# EAGLE design coracao_8bits (EAGLE 8.1.0)
CNAME: Chaveiro no formato de coracao de 8bits; CREVISION: 1.0; DESIGNER: Pedro Pinheiro

## Sheet 1 of 6
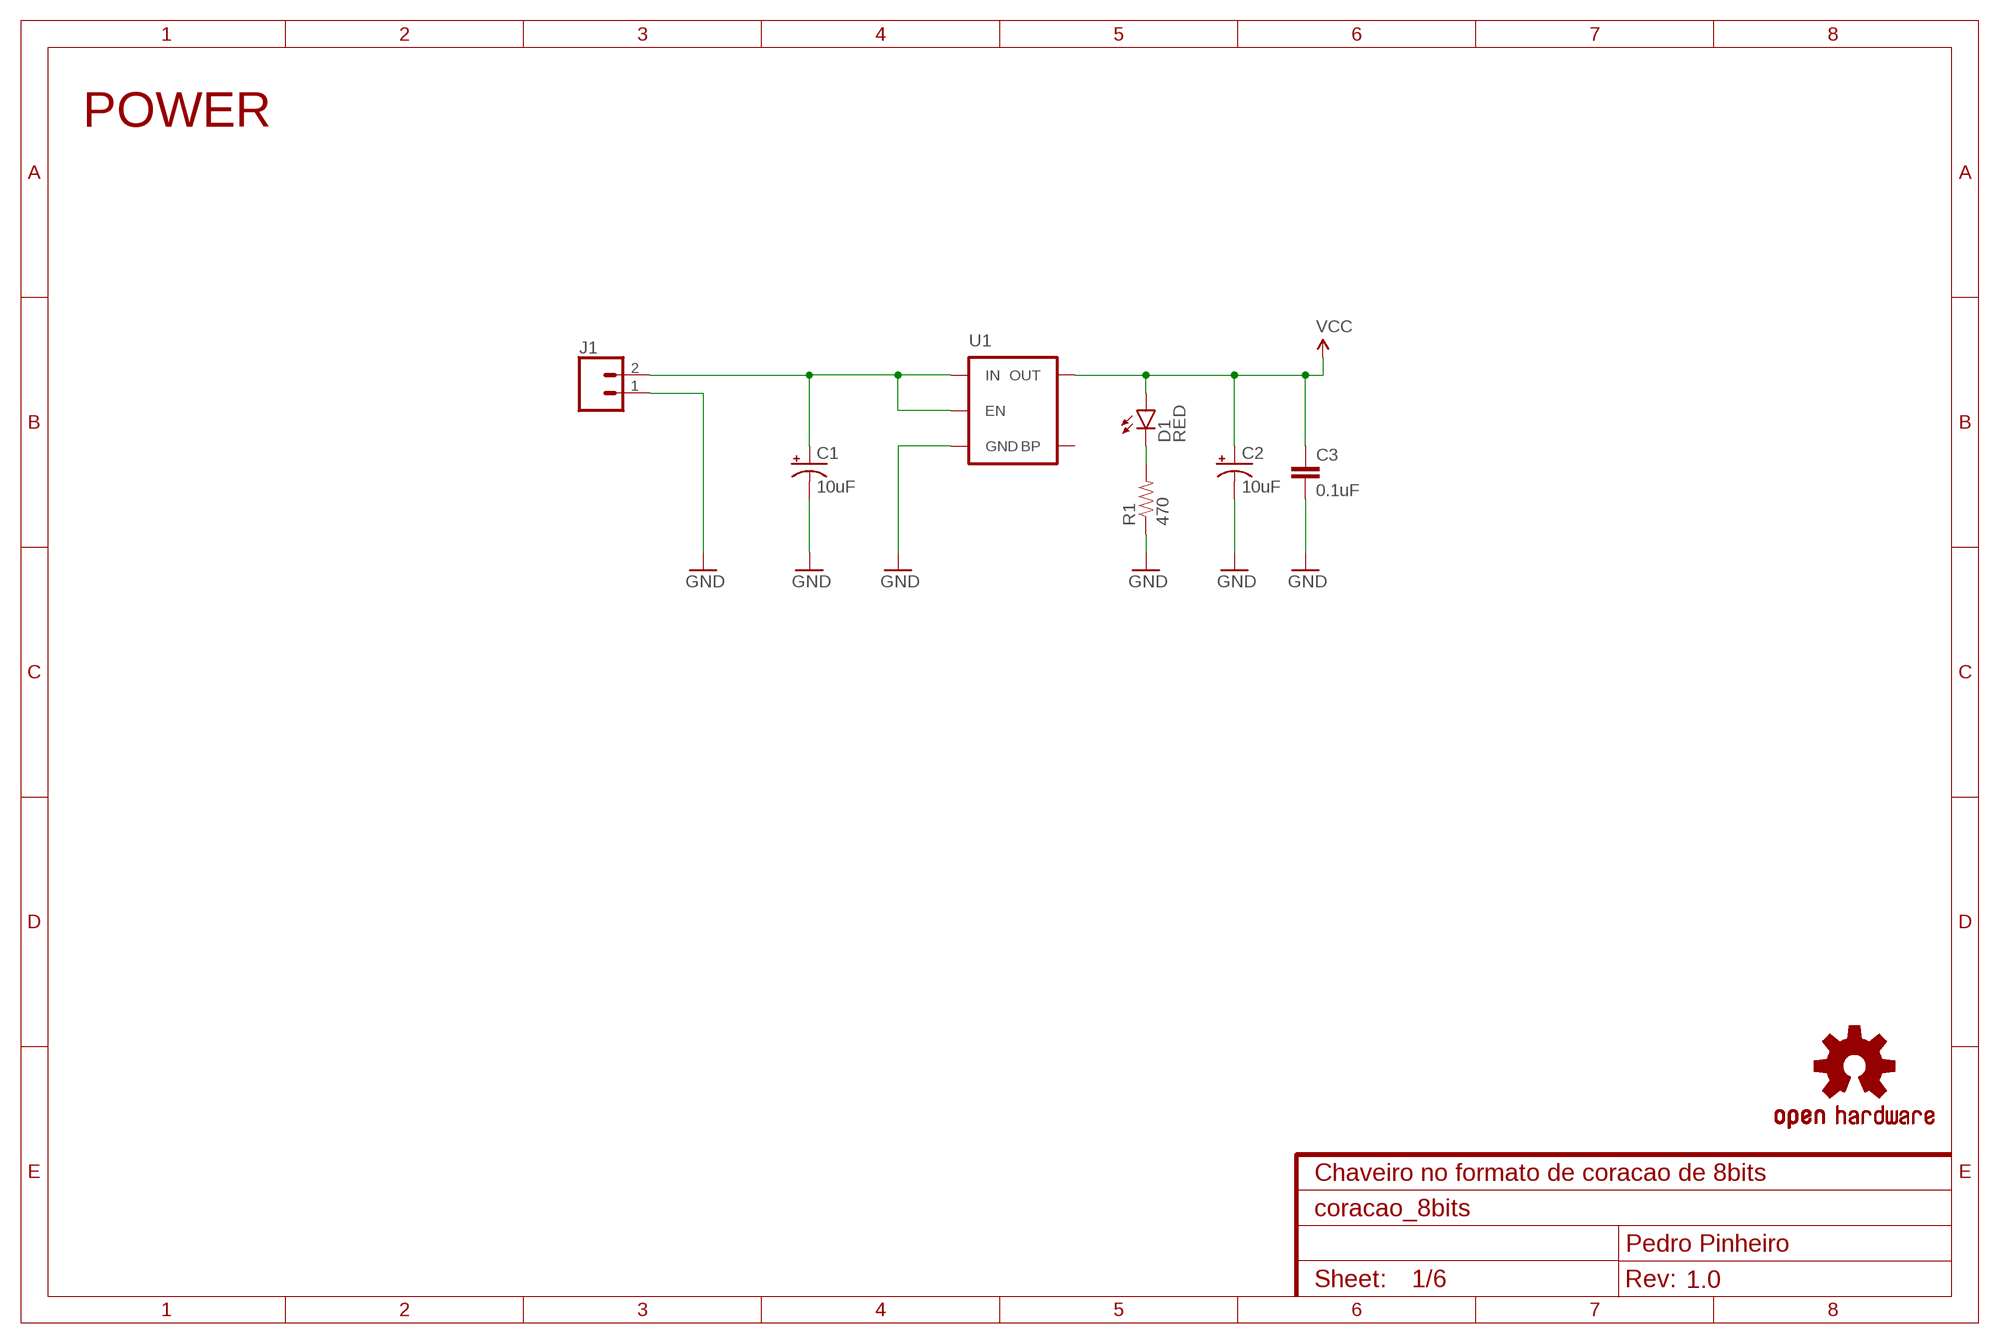
[diagram p0: schematic, sheet 1]

### Parts
C1  10uF  CAP_POL1206  [EIA3216]
C2  10uF  CAP_POL1206  [EIA3216]
C3  0.1uF  0.1UF-25V-5%(0603)  [0603-CAP]
D1  RED  LED-RED0603  [LED-0603]
J1  CONN_02  [1X02]
LOGO1  OSHW-LOGOMINI  [OSHW-LOGO-MINI]
R1  470  470OHM1/10W1%(0603)  [0603-RES]
U1  MIC52053.3V  [SOT23-5]

### Nets
DEETE: C1.A(+) J1.2 U1.1(IN) U1.3(EN)
GND: C1.C(-) C2.C(-) C3.2 J1.1 R1.1 U1.2(GND) ; also sheet 2,3,4,5,6
N$32: D1.C R1.2
VCC: C2.A(+) C3.1 D1.A U1.5(OUT) ; also sheet 2,3,4
Unconnected: U1.4(BP)

### Notes on the sheet
- POWER

## Sheet 2 of 6
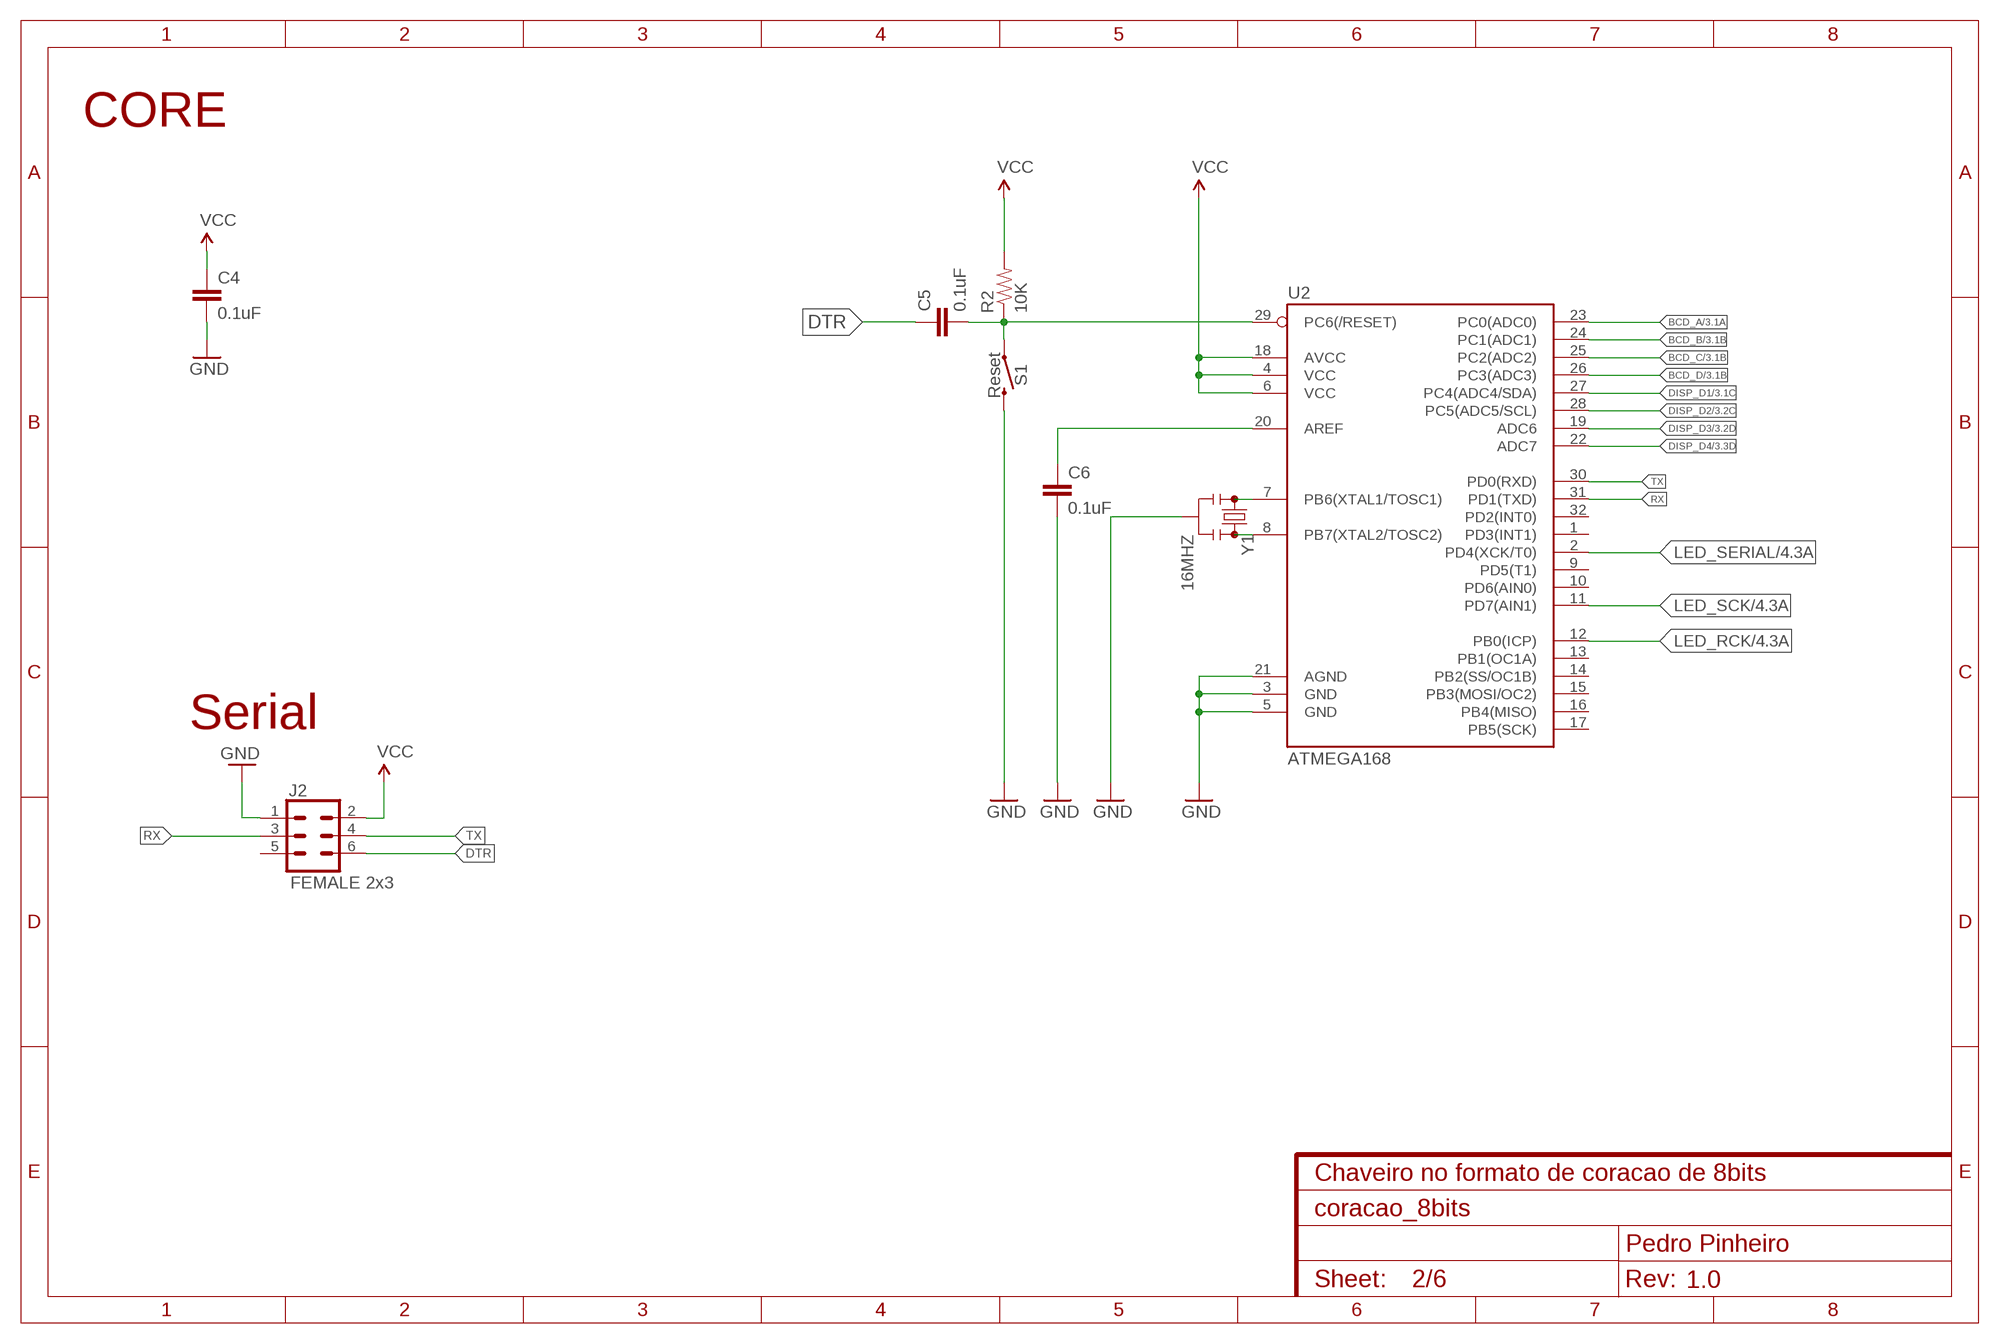
[diagram p1: schematic, sheet 2]

### Parts
C4  0.1uF  0.1UF-100V-10%(0603)  [0603-CAP]
C5  0.1uF  0.1UF-100V-10%(0603)  [0603-CAP]
C6  0.1uF  0.1UF-100V-10%(0603)  [0603-CAP]
J2  FEMALE 2x3  CONN_03X2FEMALE  [2X3]
R2  10K  10KOHM-1/10W-1%(0603)0603  [0603-RES]
S1  Reset  MOMENTARY-SWITCH-SPST-SMD-6.0X3.5MM  [TACTILE_SWITCH_SMD_6.0X3.5MM]
U2  ATMEGA168  [TQFP32-08]
Y1  16MHZ  RESONATOR16MHZ  [RESONATOR-SMD]

### Nets
BCD_A: U2.23(PC0(ADC0)) ; also sheet 3
BCD_B: U2.24(PC1(ADC1)) ; also sheet 3
BCD_C: U2.25(PC2(ADC2)) ; also sheet 3
BCD_D: U2.26(PC3(ADC3)) ; also sheet 3
DISP_D1: U2.27(PC4(ADC4/SDA)) ; also sheet 3
DISP_D2: U2.28(PC5(ADC5/SCL)) ; also sheet 3
DISP_D3: U2.19(ADC6) ; also sheet 3
DISP_D4: U2.22(ADC7) ; also sheet 3
DTR: C5.1 J2.6
GND: C4.2 C6.2 J2.1 S1.2 U2.3(GND) U2.5(GND) U2.21(AGND) Y1.2 ; also sheet 1,3,4,5,6
LED_RCK: U2.12(PB0(ICP)) ; also sheet 4
LED_SCK: U2.11(PD7(AIN1)) ; also sheet 4
LED_SERIAL: U2.2(PD4(XCK/T0)) ; also sheet 4
N$27: U2.7(PB6(XTAL1/TOSC1)) Y1.1
N$28: U2.8(PB7(XTAL2/TOSC2)) Y1.3
N$29: C6.1 U2.20(AREF)
N$30: C5.2 R2.1 S1.1 U2.29(PC6(/RESET))
RX: J2.3 U2.31(PD1(TXD))
TX: J2.4 U2.30(PD0(RXD))
VCC: C4.1 J2.2 R2.2 U2.4(VCC) U2.6(VCC) U2.18(AVCC) ; also sheet 1,3,4
Unconnected: J2.5 U2.1(PD3(INT1)) U2.9(PD5(T1)) U2.10(PD6(AIN0)) U2.13(PB1(OC1A)) U2.14(PB2(SS/OC1B)) U2.15(PB3(MOSI/OC2)) U2.16(PB4(MISO)) U2.17(PB5(SCK)) U2.32(PD2(INT0))

### Notes on the sheet
- CORE
- Serial

## Sheet 3 of 6
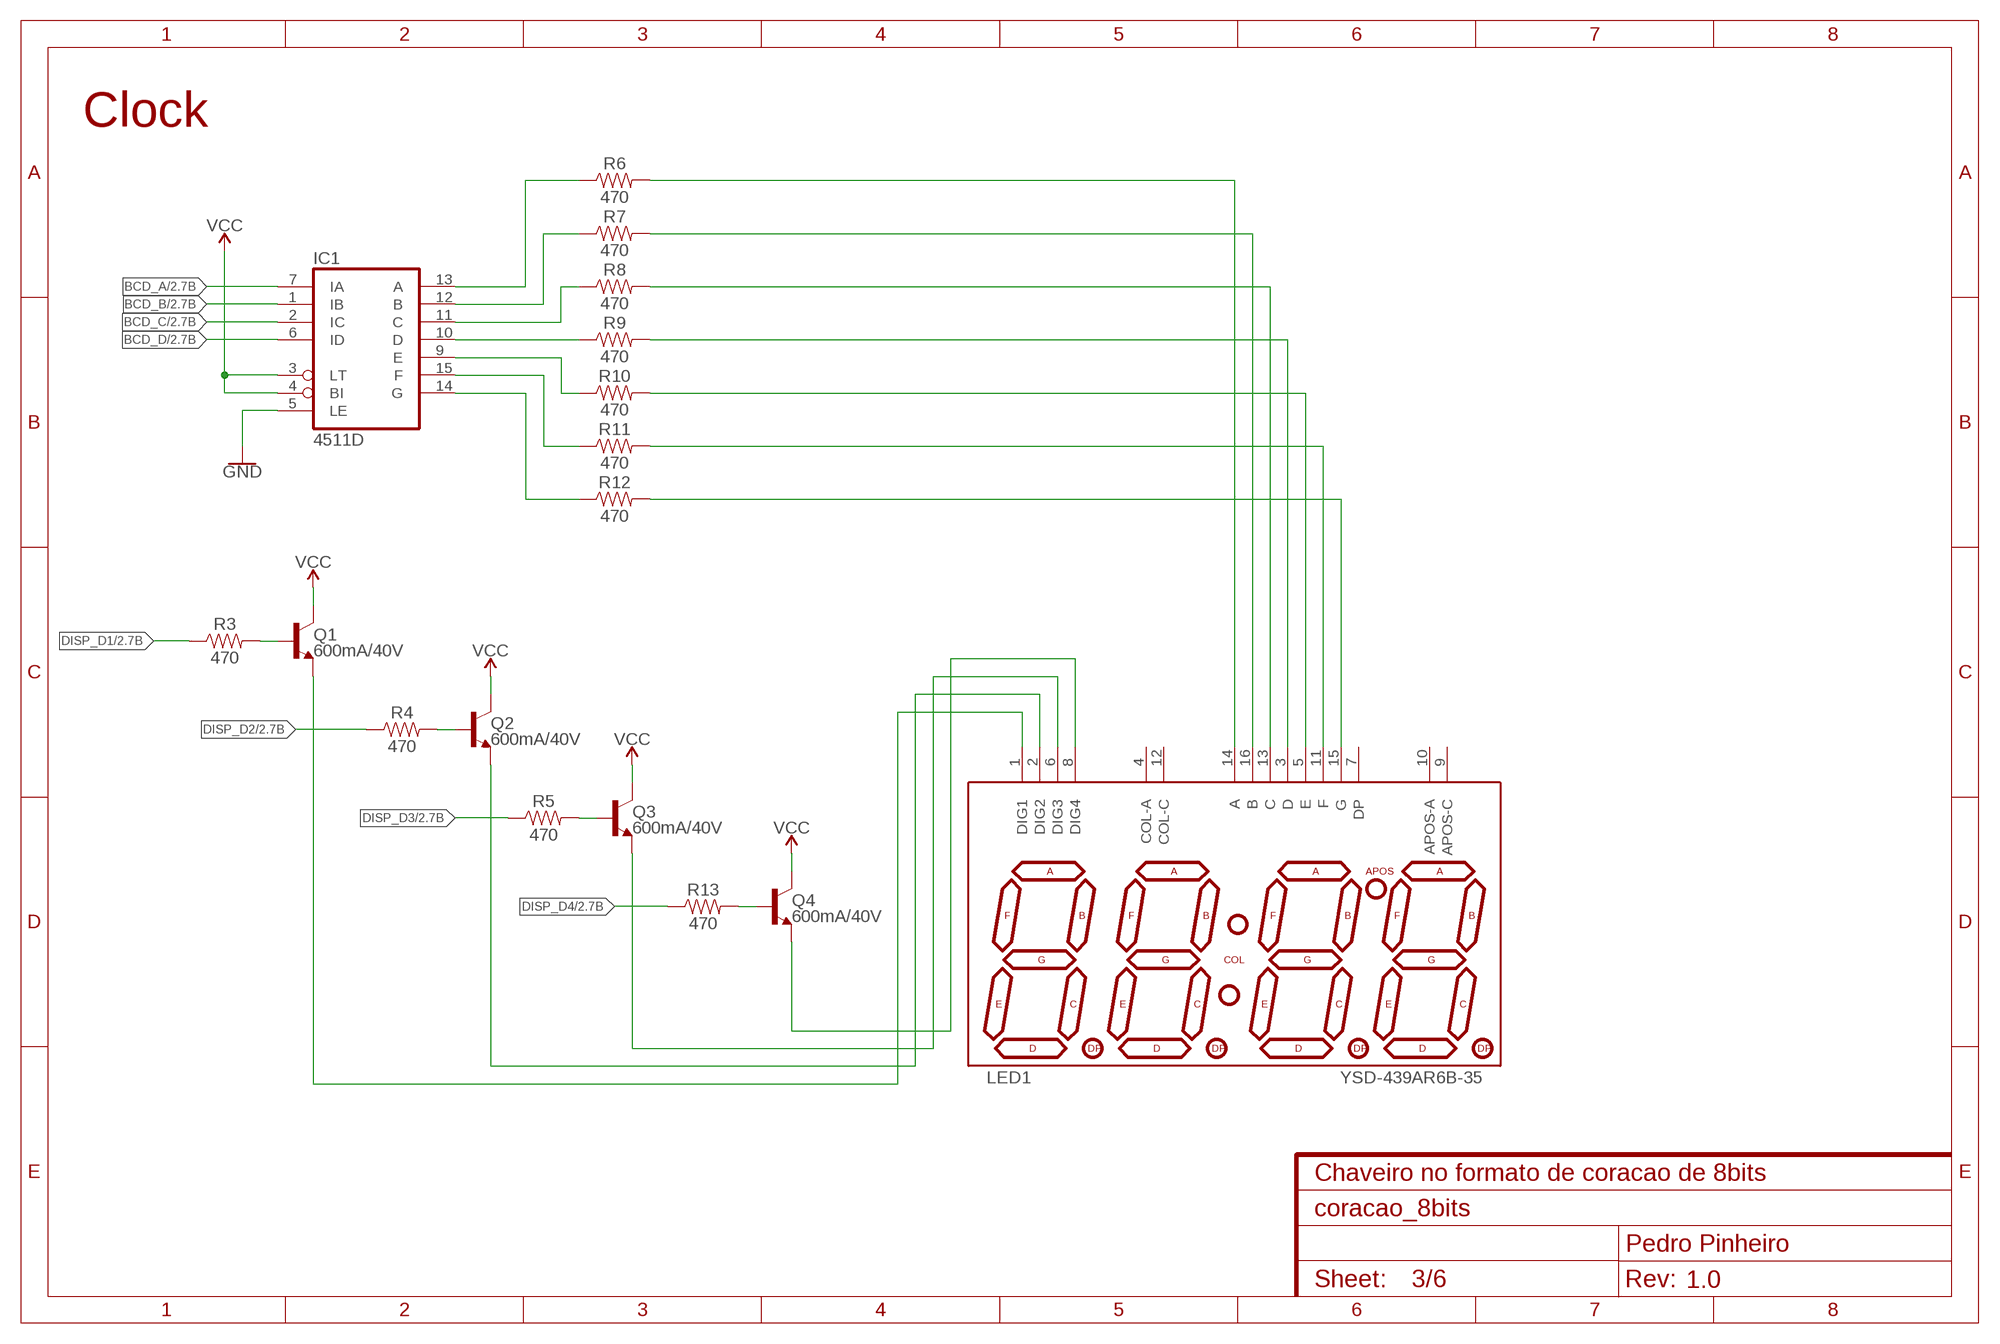
[diagram p2: schematic, sheet 3]

### Parts
IC1  4511D  [SO16]
LED1  YSD-439AR6B-35  7-SEGMENT-4DIGIT-10MM-RED  [7-SEGMENT-4DIGIT-YOUNGSUN]
Q1  600mA/40V  TRANS_NPN-MMBT2222AL  [SOT23-3]
Q2  600mA/40V  TRANS_NPN-MMBT2222AL  [SOT23-3]
Q3  600mA/40V  TRANS_NPN-MMBT2222AL  [SOT23-3]
Q4  600mA/40V  TRANS_NPN-MMBT2222AL  [SOT23-3]
R3  470  470OHM-0603-1/10W-1%  [0603]
R4  470  470OHM-0603-1/10W-1%  [0603]
R5  470  470OHM-0603-1/10W-1%  [0603]
R6  470  470OHM-0603-1/10W-1%  [0603]
R7  470  470OHM-0603-1/10W-1%  [0603]
R8  470  470OHM-0603-1/10W-1%  [0603]
R9  470  470OHM-0603-1/10W-1%  [0603]
R10  470  470OHM-0603-1/10W-1%  [0603]
R11  470  470OHM-0603-1/10W-1%  [0603]
R12  470  470OHM-0603-1/10W-1%  [0603]
R13  470  470OHM-0603-1/10W-1%  [0603]

### Nets
BCD_A: IC1.7(IA) ; also sheet 2
BCD_B: IC1.1(IB) ; also sheet 2
BCD_C: IC1.2(IC) ; also sheet 2
BCD_D: IC1.6(ID) ; also sheet 2
DISP_D1: R3.1 ; also sheet 2
DISP_D2: R4.1 ; also sheet 2
DISP_D3: R5.1 ; also sheet 2
DISP_D4: R13.1 ; also sheet 2
GND: IC1.5(LE) ; also sheet 1,2,4,5,6
N$31: IC1.10(D) R9.1
N$33: IC1.11(C) R8.1
N$34: IC1.12(B) R7.1
N$35: IC1.13(A) R6.1
N$36: IC1.9(E) R10.1
N$37: IC1.15(F) R11.1
N$38: IC1.14(G) R12.1
N$39: LED1.14(A) R6.2
N$42: LED1.16(B) R7.2
N$43: LED1.13(C) R8.2
N$44: LED1.3(D) R9.2
N$45: LED1.5(E) R10.2
N$46: LED1.11(F) R11.2
N$47: LED1.15(G) R12.2
N$48: LED1.8(DIG4) Q4.2(E)
N$49: LED1.6(DIG3) Q3.2(E)
N$50: LED1.2(DIG2) Q2.2(E)
N$51: LED1.1(DIG1) Q1.2(E)
N$52: Q2.1(B) R4.2
N$53: Q4.1(B) R13.2
N$54: Q3.1(B) R5.2
N$55: Q1.1(B) R3.2
VCC: IC1.3(LT) IC1.4(BI) Q1.3(C) Q2.3(C) Q3.3(C) Q4.3(C) ; also sheet 1,2,4
Unconnected: LED1.4(COL-A) LED1.7(DP) LED1.9(APOS-C) LED1.10(APOS-A) LED1.12(COL-C)

### Notes on the sheet
- Clock

## Sheet 4 of 6
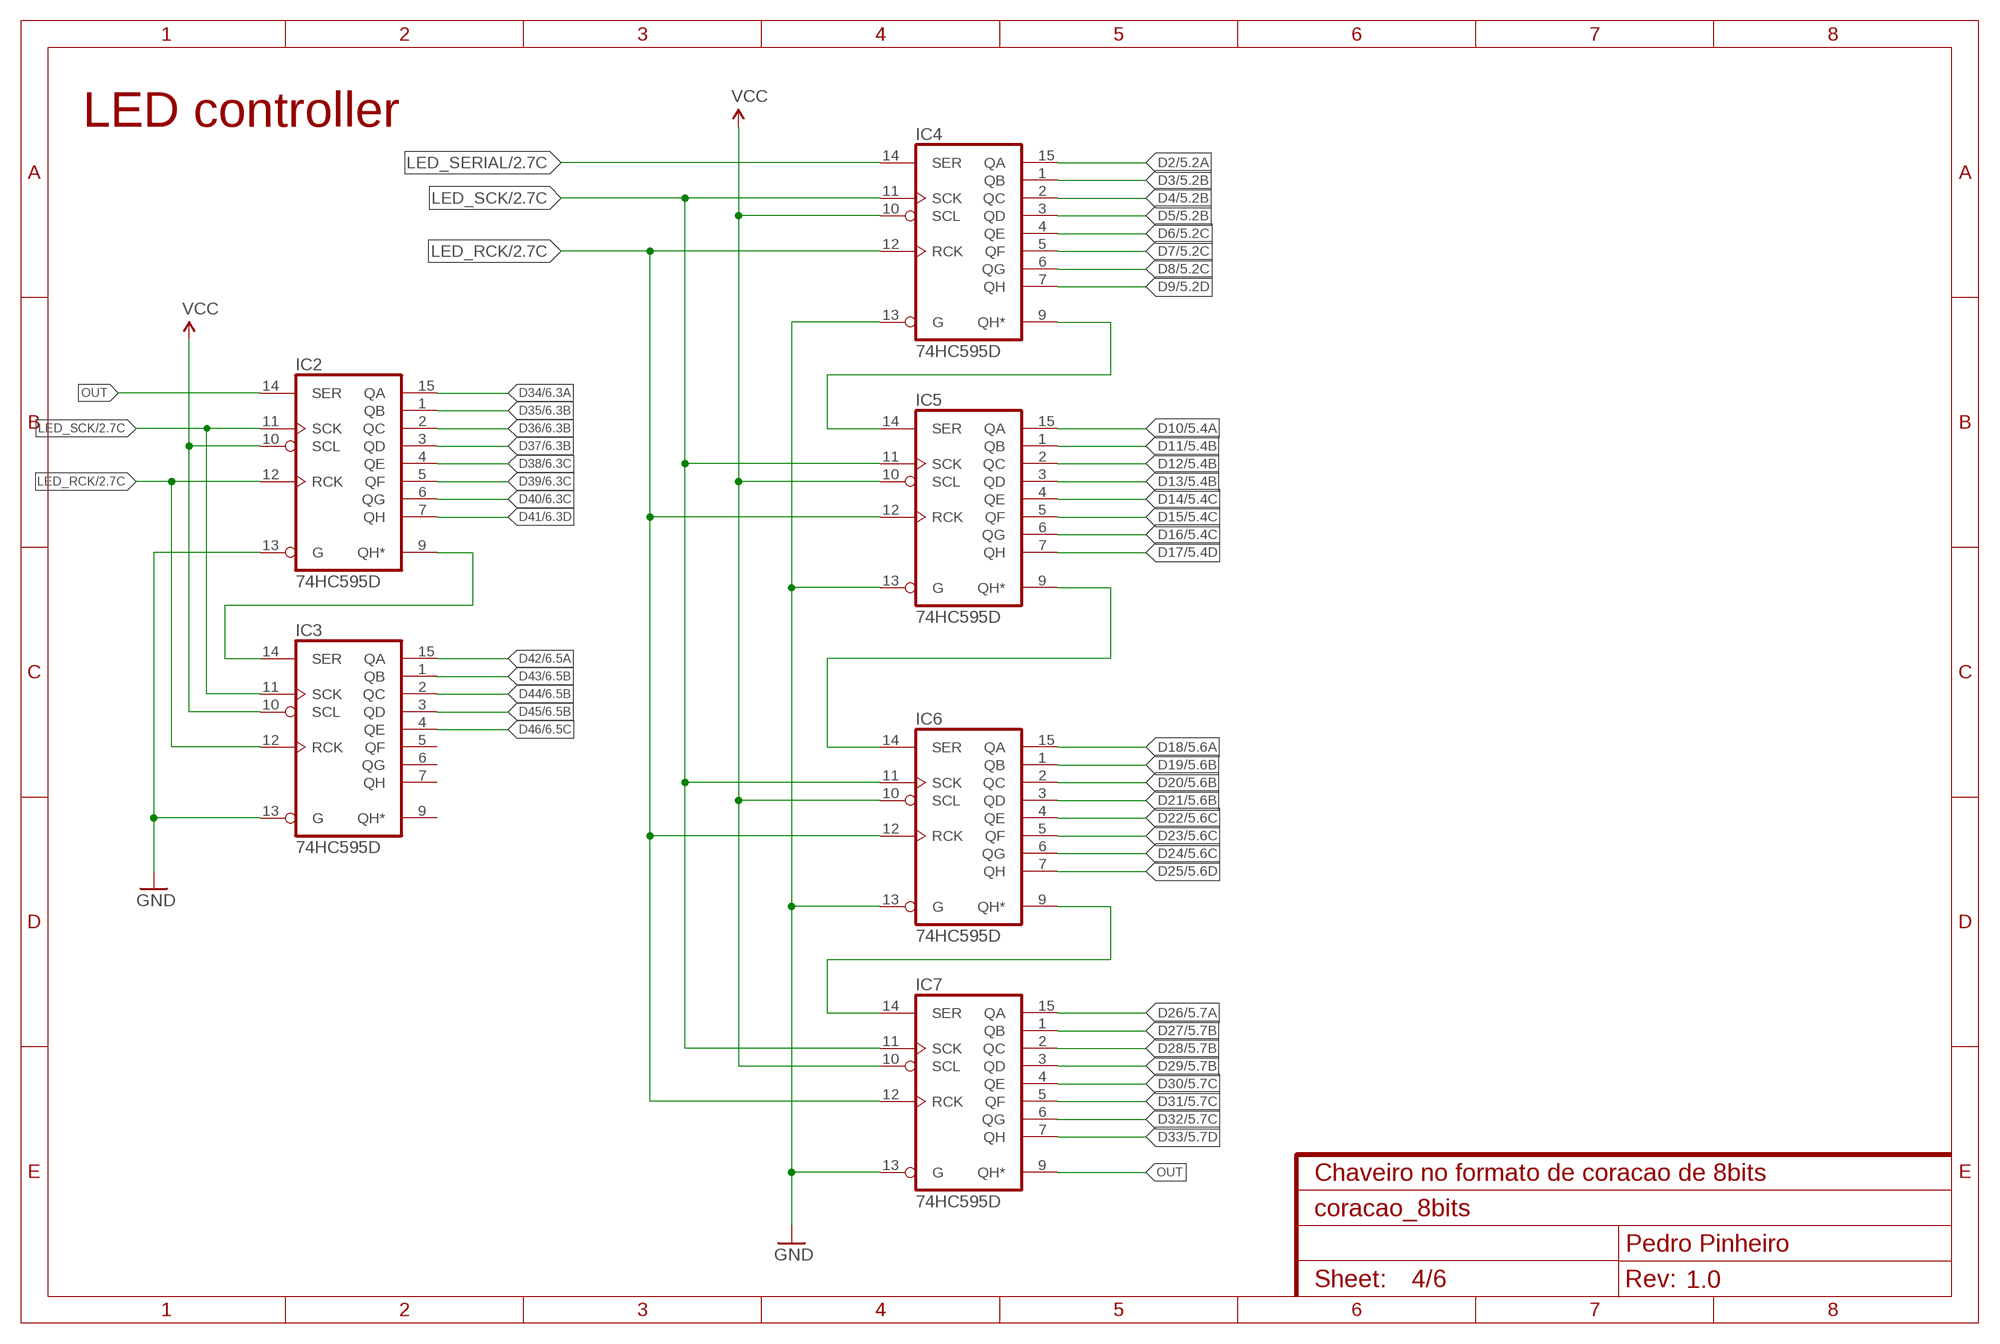
[diagram p3: schematic, sheet 4]

### Parts
IC2  74HC595D  [SO16]
IC3  74HC595D  [SO16]
IC4  74HC595D  [SO16]
IC5  74HC595D  [SO16]
IC6  74HC595D  [SO16]
IC7  74HC595D  [SO16]

### Nets
D2: IC4.15(QA) ; also sheet 5
D3: IC4.1(QB) ; also sheet 5
D4: IC4.2(QC) ; also sheet 5
D5: IC4.3(QD) ; also sheet 5
D6: IC4.4(QE) ; also sheet 5
D7: IC4.5(QF) ; also sheet 5
D8: IC4.6(QG) ; also sheet 5
D9: IC4.7(QH) ; also sheet 5
D10: IC5.15(QA) ; also sheet 5
D11: IC5.1(QB) ; also sheet 5
D12: IC5.2(QC) ; also sheet 5
D13: IC5.3(QD) ; also sheet 5
D14: IC5.4(QE) ; also sheet 5
D15: IC5.5(QF) ; also sheet 5
D16: IC5.6(QG) ; also sheet 5
D17: IC5.7(QH) ; also sheet 5
D18: IC6.15(QA) ; also sheet 5
D19: IC6.1(QB) ; also sheet 5
D20: IC6.2(QC) ; also sheet 5
D21: IC6.3(QD) ; also sheet 5
D22: IC6.4(QE) ; also sheet 5
D23: IC6.5(QF) ; also sheet 5
D24: IC6.6(QG) ; also sheet 5
D25: IC6.7(QH) ; also sheet 5
D26: IC7.15(QA) ; also sheet 5
D27: IC7.1(QB) ; also sheet 5
D28: IC7.2(QC) ; also sheet 5
D29: IC7.3(QD) ; also sheet 5
D30: IC7.4(QE) ; also sheet 5
D31: IC7.5(QF) ; also sheet 5
D32: IC7.6(QG) ; also sheet 5
D33: IC7.7(QH) ; also sheet 5
D34: IC2.15(QA) ; also sheet 6
D35: IC2.1(QB) ; also sheet 6
D36: IC2.2(QC) ; also sheet 6
D37: IC2.3(QD) ; also sheet 6
D38: IC2.4(QE) ; also sheet 6
D39: IC2.5(QF) ; also sheet 6
D40: IC2.6(QG) ; also sheet 6
D41: IC2.7(QH) ; also sheet 6
D42: IC3.15(QA) ; also sheet 6
D43: IC3.1(QB) ; also sheet 6
D44: IC3.2(QC) ; also sheet 6
D45: IC3.3(QD) ; also sheet 6
D46: IC3.4(QE) ; also sheet 6
GND: IC2.13(G) IC3.13(G) IC4.13(G) IC5.13(G) IC6.13(G) IC7.13(G) ; also sheet 1,2,3,5,6
LED_RCK: IC2.12(RCK) IC3.12(RCK) IC4.12(RCK) IC5.12(RCK) IC6.12(RCK) IC7.12(RCK) ; also sheet 2
LED_SCK: IC2.11(SCK) IC3.11(SCK) IC4.11(SCK) IC5.11(SCK) IC6.11(SCK) IC7.11(SCK) ; also sheet 2
LED_SERIAL: IC4.14(SER) ; also sheet 2
N$40: IC4.9(QH*) IC5.14(SER)
N$41: IC6.9(QH*) IC7.14(SER)
N$63: IC2.9(QH*) IC3.14(SER)
N$104: IC5.9(QH*) IC6.14(SER)
OUT: IC2.14(SER) IC7.9(QH*)
VCC: IC2.10(SCL) IC3.10(SCL) IC4.10(SCL) IC5.10(SCL) IC6.10(SCL) IC7.10(SCL) ; also sheet 1,2,3
Unconnected: IC3.5(QF) IC3.6(QG) IC3.7(QH) IC3.9(QH*)

### Notes on the sheet
- LED controller

## Sheet 5 of 6
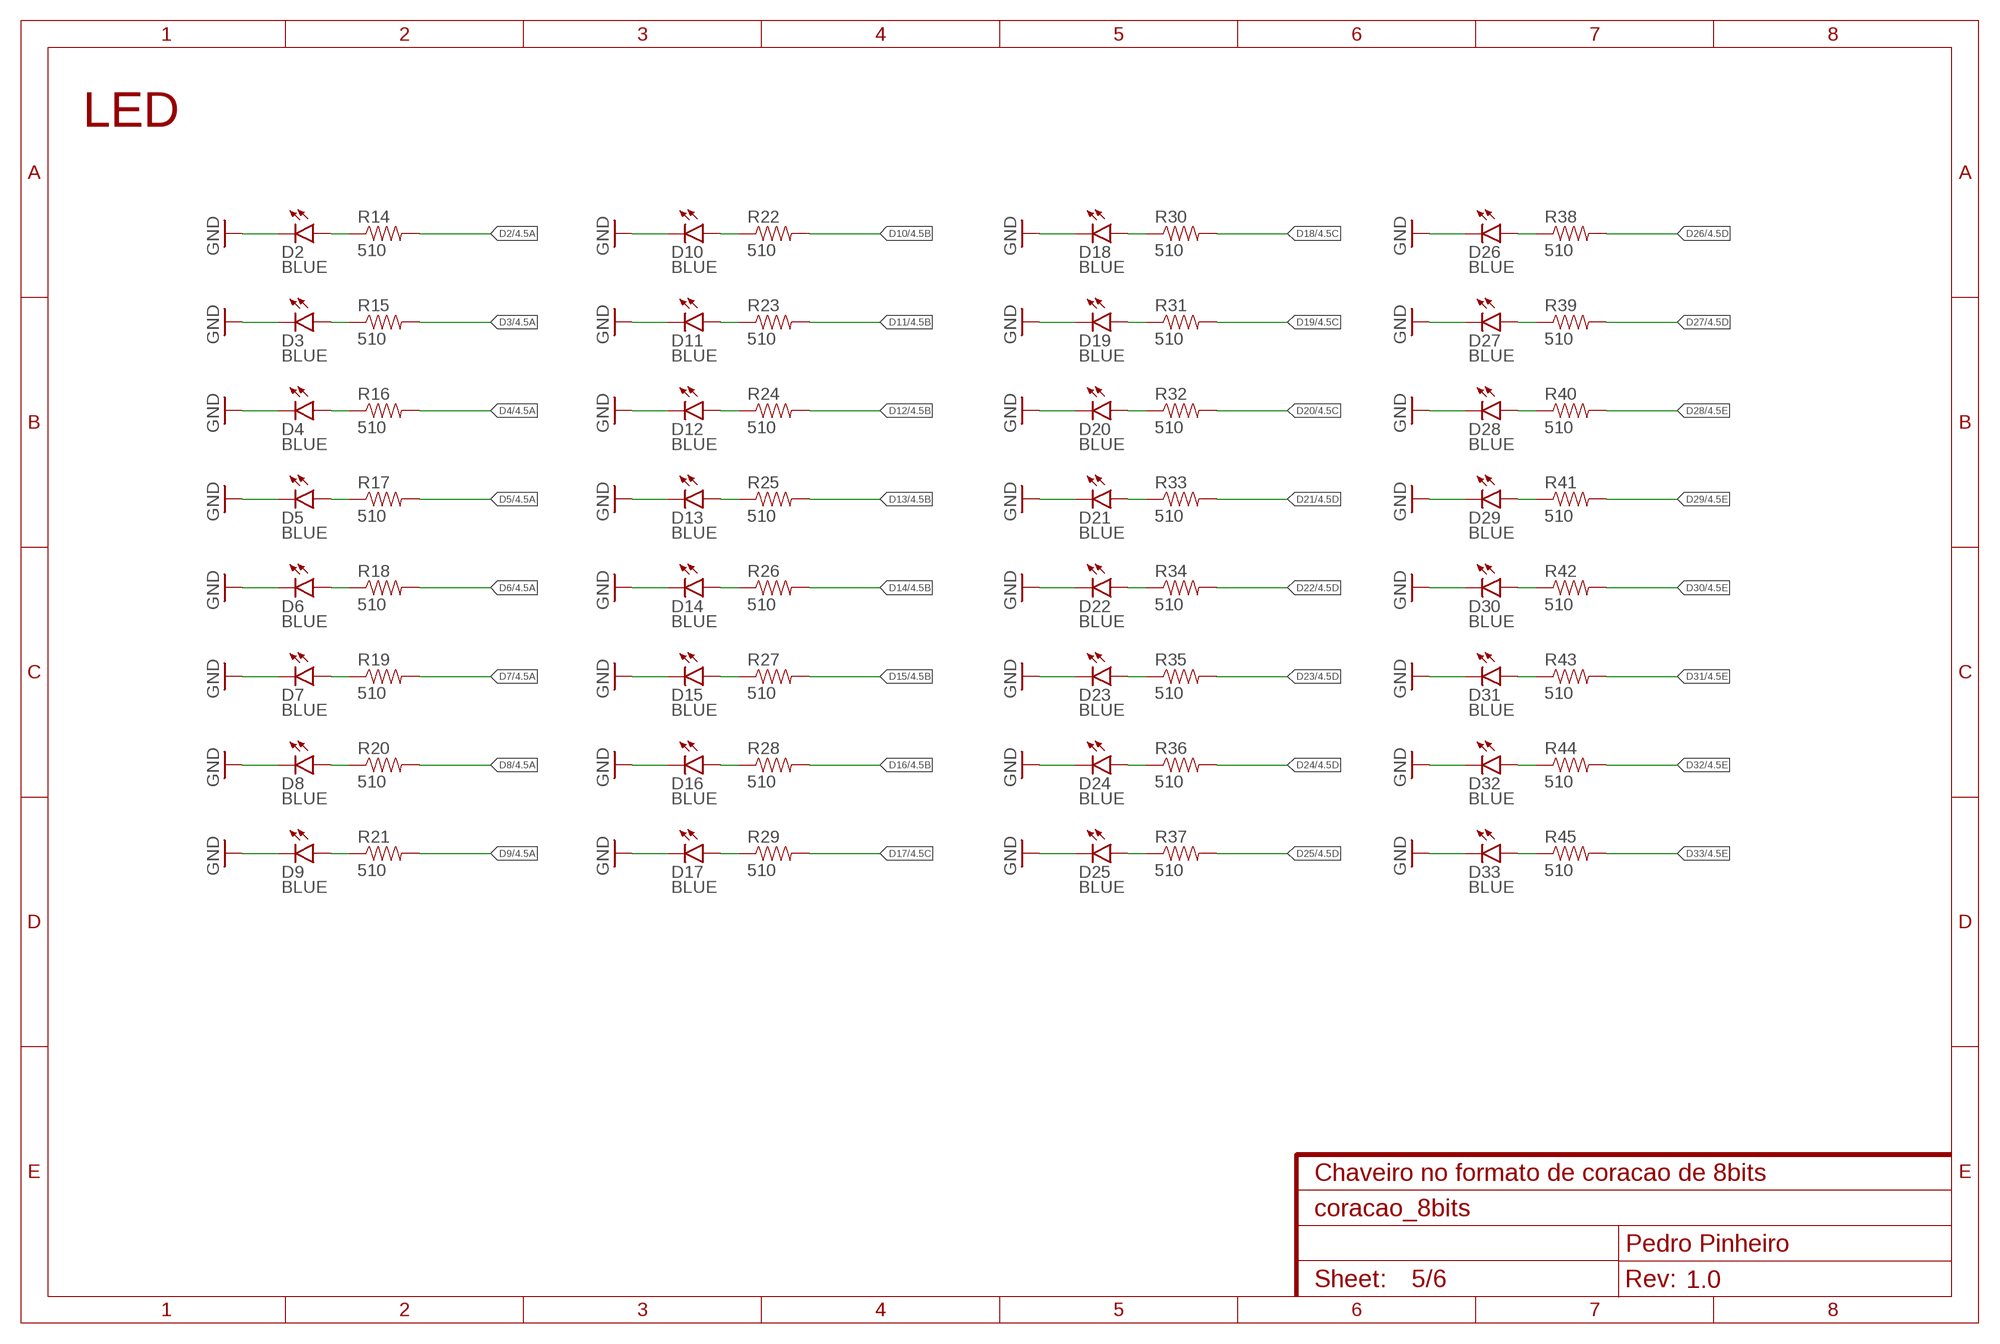
[diagram p4: schematic, sheet 5]

### Parts
D2  BLUE  LED-BLUE0603  [LED-0603]
D3  BLUE  LED-BLUE0603  [LED-0603]
D4  BLUE  LED-BLUE0603  [LED-0603]
D5  BLUE  LED-BLUE0603  [LED-0603]
D6  BLUE  LED-BLUE0603  [LED-0603]
D7  BLUE  LED-BLUE0603  [LED-0603]
D8  BLUE  LED-BLUE0603  [LED-0603]
D9  BLUE  LED-BLUE0603  [LED-0603]
D10  BLUE  LED-BLUE0603  [LED-0603]
D11  BLUE  LED-BLUE0603  [LED-0603]
D12  BLUE  LED-BLUE0603  [LED-0603]
D13  BLUE  LED-BLUE0603  [LED-0603]
D14  BLUE  LED-BLUE0603  [LED-0603]
D15  BLUE  LED-BLUE0603  [LED-0603]
D16  BLUE  LED-BLUE0603  [LED-0603]
D17  BLUE  LED-BLUE0603  [LED-0603]
D18  BLUE  LED-BLUE0603  [LED-0603]
D19  BLUE  LED-BLUE0603  [LED-0603]
D20  BLUE  LED-BLUE0603  [LED-0603]
D21  BLUE  LED-BLUE0603  [LED-0603]
D22  BLUE  LED-BLUE0603  [LED-0603]
D23  BLUE  LED-BLUE0603  [LED-0603]
D24  BLUE  LED-BLUE0603  [LED-0603]
D25  BLUE  LED-BLUE0603  [LED-0603]
D26  BLUE  LED-BLUE0603  [LED-0603]
D27  BLUE  LED-BLUE0603  [LED-0603]
D28  BLUE  LED-BLUE0603  [LED-0603]
D29  BLUE  LED-BLUE0603  [LED-0603]
D30  BLUE  LED-BLUE0603  [LED-0603]
D31  BLUE  LED-BLUE0603  [LED-0603]
D32  BLUE  LED-BLUE0603  [LED-0603]
D33  BLUE  LED-BLUE0603  [LED-0603]
R14  510  470OHM1/10W1%(0603)  [0603-RES]
R15  510  470OHM1/10W1%(0603)  [0603-RES]
R16  510  470OHM1/10W1%(0603)  [0603-RES]
R17  510  470OHM1/10W1%(0603)  [0603-RES]
R18  510  470OHM1/10W1%(0603)  [0603-RES]
R19  510  470OHM1/10W1%(0603)  [0603-RES]
R20  510  470OHM1/10W1%(0603)  [0603-RES]
R21  510  470OHM1/10W1%(0603)  [0603-RES]
R22  510  470OHM1/10W1%(0603)  [0603-RES]
R23  510  470OHM1/10W1%(0603)  [0603-RES]
R24  510  470OHM1/10W1%(0603)  [0603-RES]
R25  510  470OHM1/10W1%(0603)  [0603-RES]
R26  510  470OHM1/10W1%(0603)  [0603-RES]
R27  510  470OHM1/10W1%(0603)  [0603-RES]
R28  510  470OHM1/10W1%(0603)  [0603-RES]
R29  510  470OHM1/10W1%(0603)  [0603-RES]
R30  510  470OHM1/10W1%(0603)  [0603-RES]
R31  510  470OHM1/10W1%(0603)  [0603-RES]
R32  510  470OHM1/10W1%(0603)  [0603-RES]
R33  510  470OHM1/10W1%(0603)  [0603-RES]
R34  510  470OHM1/10W1%(0603)  [0603-RES]
R35  510  470OHM1/10W1%(0603)  [0603-RES]
R36  510  470OHM1/10W1%(0603)  [0603-RES]
R37  510  470OHM1/10W1%(0603)  [0603-RES]
R38  510  470OHM1/10W1%(0603)  [0603-RES]
R39  510  470OHM1/10W1%(0603)  [0603-RES]
R40  510  470OHM1/10W1%(0603)  [0603-RES]
R41  510  470OHM1/10W1%(0603)  [0603-RES]
R42  510  470OHM1/10W1%(0603)  [0603-RES]
R43  510  470OHM1/10W1%(0603)  [0603-RES]
R44  510  470OHM1/10W1%(0603)  [0603-RES]
R45  510  470OHM1/10W1%(0603)  [0603-RES]

### Nets
D2: R14.2 ; also sheet 4
D3: R15.2 ; also sheet 4
D4: R16.2 ; also sheet 4
D5: R17.2 ; also sheet 4
D6: R18.2 ; also sheet 4
D7: R19.2 ; also sheet 4
D8: R20.2 ; also sheet 4
D9: R21.2 ; also sheet 4
D10: R22.2 ; also sheet 4
D11: R23.2 ; also sheet 4
D12: R24.2 ; also sheet 4
D13: R25.2 ; also sheet 4
D14: R26.2 ; also sheet 4
D15: R27.2 ; also sheet 4
D16: R28.2 ; also sheet 4
D17: R29.2 ; also sheet 4
D18: R30.2 ; also sheet 4
D19: R31.2 ; also sheet 4
D20: R32.2 ; also sheet 4
D21: R33.2 ; also sheet 4
D22: R34.2 ; also sheet 4
D23: R35.2 ; also sheet 4
D24: R36.2 ; also sheet 4
D25: R37.2 ; also sheet 4
D26: R38.2 ; also sheet 4
D27: R39.2 ; also sheet 4
D28: R40.2 ; also sheet 4
D29: R41.2 ; also sheet 4
D30: R42.2 ; also sheet 4
D31: R43.2 ; also sheet 4
D32: R44.2 ; also sheet 4
D33: R45.2 ; also sheet 4
GND: D2.C D3.C D4.C D5.C D6.C D7.C D8.C D9.C D10.C D11.C D12.C D13.C D14.C D15.C D16.C D17.C D18.C D19.C D20.C D21.C D22.C D23.C D24.C D25.C D26.C D27.C D28.C D29.C D30.C D31.C D32.C D33.C ; also sheet 1,2,3,4,6
N$1: D2.A R14.1
N$2: D3.A R15.1
N$3: D4.A R16.1
N$4: D5.A R17.1
N$5: D6.A R18.1
N$6: D7.A R19.1
N$7: D8.A R20.1
N$8: D9.A R21.1
N$9: D10.A R22.1
N$10: D11.A R23.1
N$11: D12.A R24.1
N$12: D13.A R25.1
N$13: D14.A R26.1
N$14: D15.A R27.1
N$15: D16.A R28.1
N$16: D17.A R29.1
N$17: D18.A R30.1
N$18: D19.A R31.1
N$19: D20.A R32.1
N$20: D21.A R33.1
N$21: D22.A R34.1
N$22: D23.A R35.1
N$23: D24.A R36.1
N$24: D25.A R37.1
N$25: D26.A R38.1
N$26: D27.A R39.1
N$56: D28.A R40.1
N$57: D29.A R41.1
N$58: D30.A R42.1
N$59: D31.A R43.1
N$60: D32.A R44.1
N$61: D33.A R45.1

### Notes on the sheet
- LED

## Sheet 6 of 6
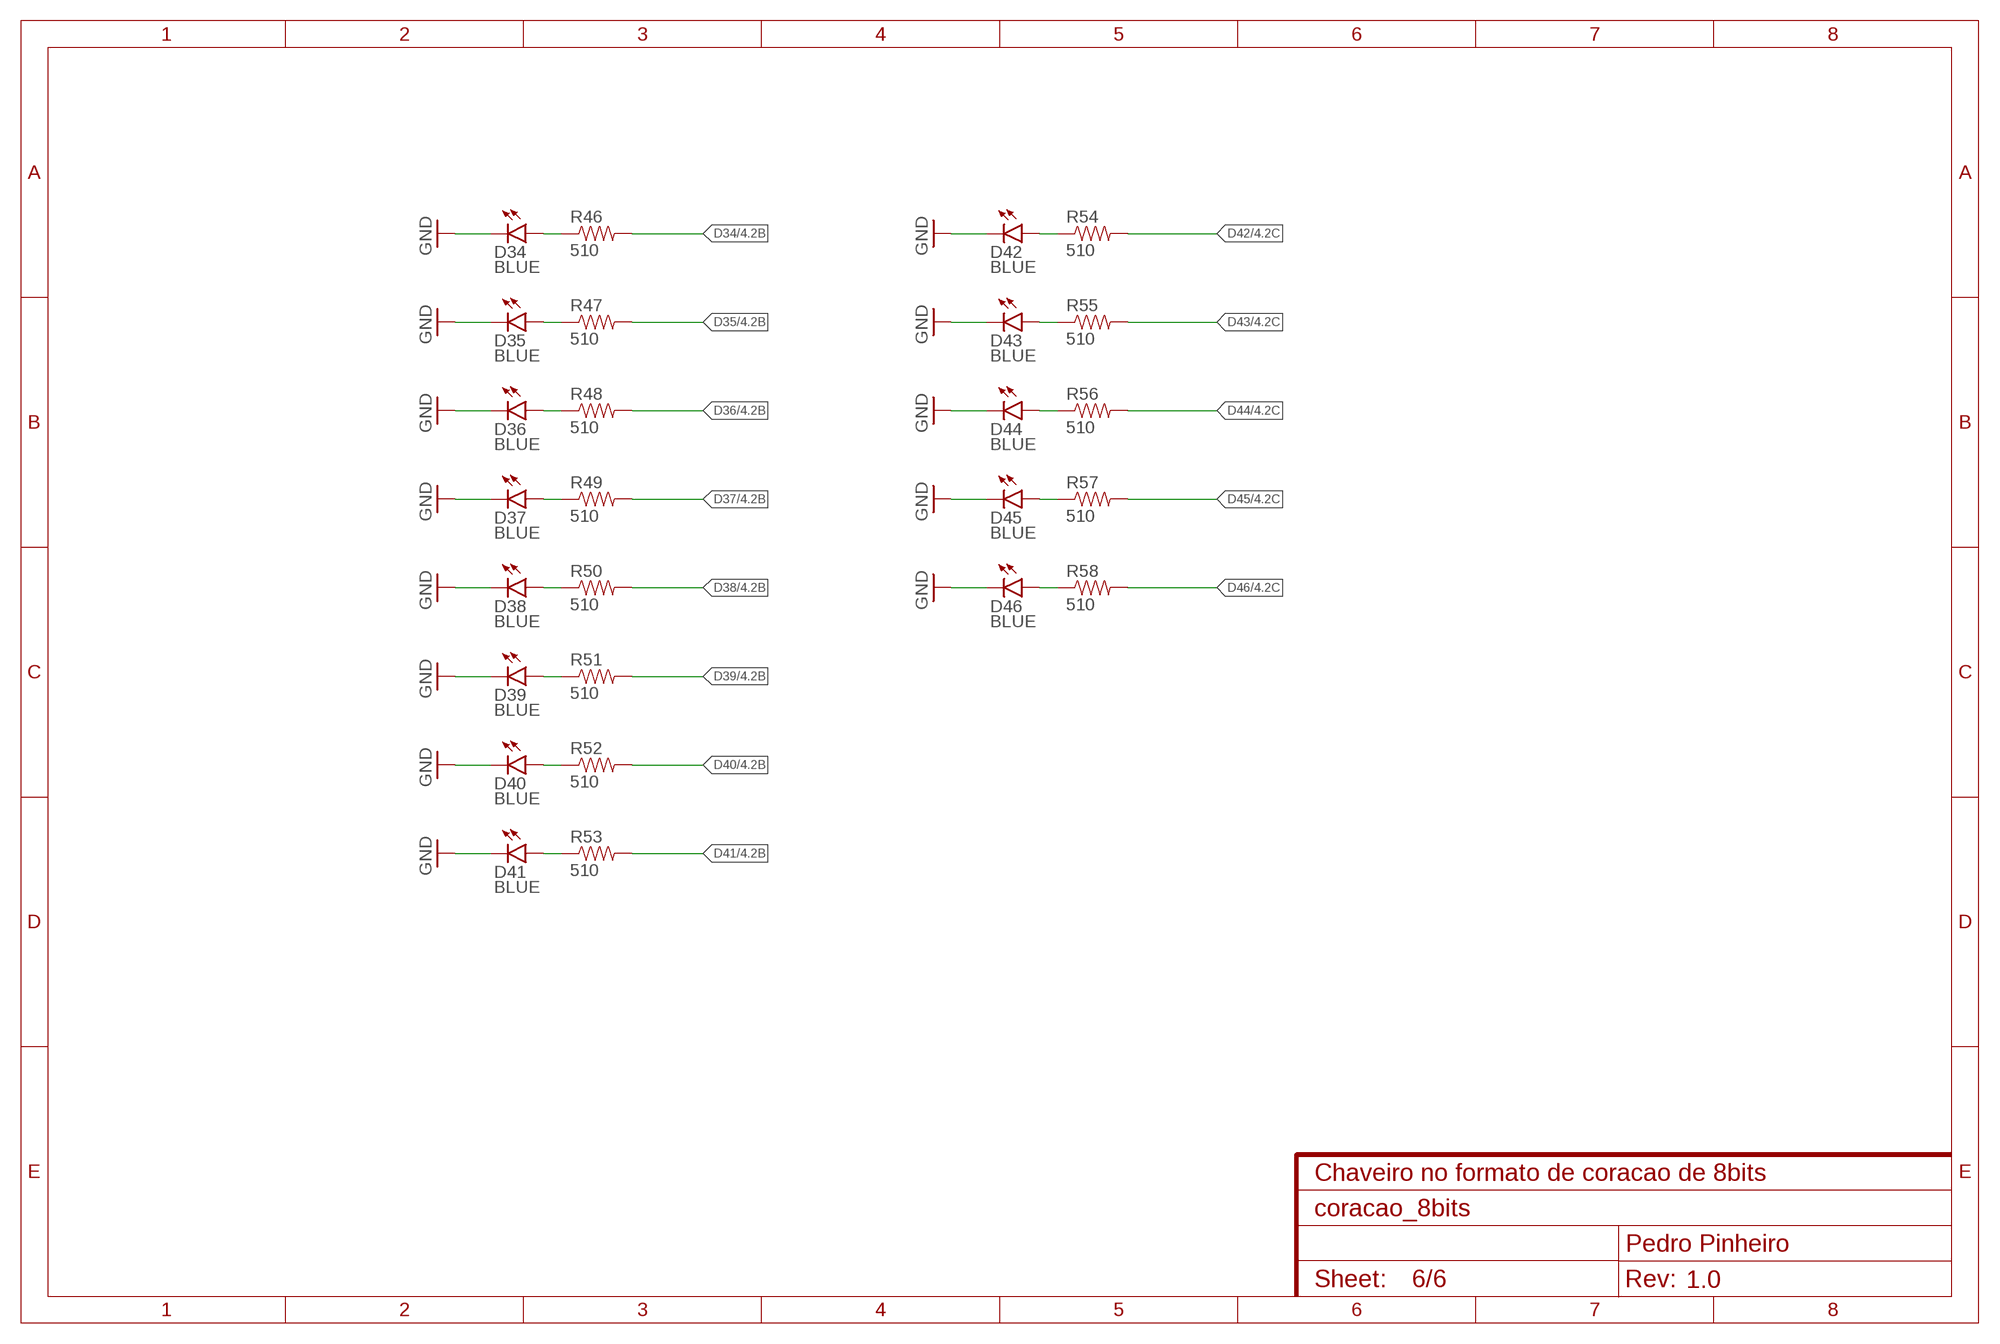
[diagram p5: schematic, sheet 6]

### Parts
D34  BLUE  LED-BLUE0603  [LED-0603]
D35  BLUE  LED-BLUE0603  [LED-0603]
D36  BLUE  LED-BLUE0603  [LED-0603]
D37  BLUE  LED-BLUE0603  [LED-0603]
D38  BLUE  LED-BLUE0603  [LED-0603]
D39  BLUE  LED-BLUE0603  [LED-0603]
D40  BLUE  LED-BLUE0603  [LED-0603]
D41  BLUE  LED-BLUE0603  [LED-0603]
D42  BLUE  LED-BLUE0603  [LED-0603]
D43  BLUE  LED-BLUE0603  [LED-0603]
D44  BLUE  LED-BLUE0603  [LED-0603]
D45  BLUE  LED-BLUE0603  [LED-0603]
D46  BLUE  LED-BLUE0603  [LED-0603]
R46  510  470OHM1/10W1%(0603)  [0603-RES]
R47  510  470OHM1/10W1%(0603)  [0603-RES]
R48  510  470OHM1/10W1%(0603)  [0603-RES]
R49  510  470OHM1/10W1%(0603)  [0603-RES]
R50  510  470OHM1/10W1%(0603)  [0603-RES]
R51  510  470OHM1/10W1%(0603)  [0603-RES]
R52  510  470OHM1/10W1%(0603)  [0603-RES]
R53  510  470OHM1/10W1%(0603)  [0603-RES]
R54  510  470OHM1/10W1%(0603)  [0603-RES]
R55  510  470OHM1/10W1%(0603)  [0603-RES]
R56  510  470OHM1/10W1%(0603)  [0603-RES]
R57  510  470OHM1/10W1%(0603)  [0603-RES]
R58  510  470OHM1/10W1%(0603)  [0603-RES]

### Nets
D34: R46.2 ; also sheet 4
D35: R47.2 ; also sheet 4
D36: R48.2 ; also sheet 4
D37: R49.2 ; also sheet 4
D38: R50.2 ; also sheet 4
D39: R51.2 ; also sheet 4
D40: R52.2 ; also sheet 4
D41: R53.2 ; also sheet 4
D42: R54.2 ; also sheet 4
D43: R55.2 ; also sheet 4
D44: R56.2 ; also sheet 4
D45: R57.2 ; also sheet 4
D46: R58.2 ; also sheet 4
GND: D34.C D35.C D36.C D37.C D38.C D39.C D40.C D41.C D42.C D43.C D44.C D45.C D46.C ; also sheet 1,2,3,4,5
N$62: D34.A R46.1
N$64: D35.A R47.1
N$65: D36.A R48.1
N$66: D37.A R49.1
N$67: D38.A R50.1
N$68: D39.A R51.1
N$69: D40.A R52.1
N$70: D41.A R53.1
N$71: D42.A R54.1
N$72: D43.A R55.1
N$73: D44.A R56.1
N$74: D45.A R57.1
N$75: D46.A R58.1

## Power pins joined to a net without a drawn wire
GND: IC2.8(GND) IC3.8(GND) IC4.8(GND) IC5.8(GND) IC6.8(GND) IC7.8(GND)
VCC: IC2.16(VCC) IC3.16(VCC) IC4.16(VCC) IC5.16(VCC) IC6.16(VCC) IC7.16(VCC)
VDD: IC1.16(VDD)
VSS: IC1.8(VSS)

## Library data of the parts
C1 C2 = SparkFun-Capacitors:CAP_POL: Capacitor Polarized These are standard SMD and PTH capacitors. Normally 10uF, 47uF, and 100uF in electrolytic and tantalum varieties. Always verify the external diameter of the through hole cap, it varies with capacity, voltage, and manufacturer. The EIA devices should be standard.
C3 = SparkFun-Capacitors:0.1UF-25V-5%(0603): CAP-08604; PROD_ID: CAP-08604
C4-C6 = SparkFun-Capacitors:0.1UF-100V-10%(0603): CAP-08390; PROD_ID: CAP-08390
D1 = SparkFun-LED:LED-RED: Assorted Red LEDs LilyPad 1206- DIO-09912 1206- DIO-00809 0603- DIO-00819 "SMART" means more efficient and expensive; PROD_ID: DIO-00819
D2-D46 = SparkFun-LED:LED-BLUE: Blue LEDs for production use Various blue LEDs stocked by SparkFun production 0603 - DIO-08575 Rebel - DIO-09553 1206 - DIO-09911; PROD_ID: DIO-08575
IC1 = 45xx:4511: BCD to 7-segment LATCH/DECODER/DRIVER
IC2-IC7 = 74xx-eu:74*595: 8-bit SHIFT REGISTER, output latch
J1 = SparkFun-Connectors:CONN_02: Multi connection point. Often used as Generic Header-pin footprint for 0.1 inch spaced/style header connections On any of the 0.1 inch spaced packages, you can populate with these: Break Away Headers - Straight <https://www.sparkfun.com/products/116> (PRT-00116) Break Away Male Headers - Right Angle <https://www.sparkfun.com/products/553> (PRT-00553) Female Headers <https://www.sparkfun.com/products/115> (PRT-00115) Break Away Headers - Machine Pin <https://www.sparkfun.com/products/117> (PRT-00117) Break Away Female Headers - Swiss Machine Pin <https://www.sparkfun.com/products/743> (PRT-00743) For SCREWTERMINALS and SPRING TERMINALS visit here: Screw Terimnals on SparkFun.com <https://www.sparkfun.com/search/results?term=Screw+Terminals> (5mm/3.5mm/2.54mm spacing) This device is also useful as a general connection point to wire up your design to another part of your project. Our various solder wires solder well into these plated through hole pads. Hook-Up Wire - Assortment (Stranded, 22 AWG) <https://www.sparkfun.com/products/11375> (PRT-11375) Hook-Up Wire - Assortment (Solid Core, 22 AWG) <https://www.sparkfun.com/products/11367> (PRT-11367) View the entire wire category on our website here <https://www.sparkfun.com/categories/141> Special notes: Molex polarized connector foot print use with: PRT-08233 with associated crimp pins and housings. 2.54_SCREWTERM for use with PRT-10571. 3.5mm Screw Terminal footprints for PRT-08084 5mm Screw Terminal footprints for use with PRT-08432
J2 = SparkFun-Connectors:CONN_03X2: Multi connection point. Often used as Generic Header-pin footprint for 0.1 inch spaced/style header connections You can populate with any combo of single row headers, but if you'd like an exact match, check these: Header - 2x3 (Male, 0.1") <https://www.sparkfun.com/products/12807> (PRT-12807) Header - 2x3 (Female, 0.1") <https://www.sparkfun.com/products/13010> (PRT-13010) 2x3 Pin Shrouded Header <https://www.sparkfun.com/products/10877> (PRT-10877) On any of the 0.1 inch spaced packages, you can populate with these: Break Away Headers - Straight <https://www.sparkfun.com/products/116> (PRT-00116) Break Away Male Headers - Right Angle <https://www.sparkfun.com/products/553> (PRT-00553) Female Headers <https://www.sparkfun.com/products/115> (PRT-00115) Break Away Headers - Machine Pin <https://www.sparkfun.com/products/117> (PRT-00117) Break Away Female Headers - Swiss Machine Pin <https://www.sparkfun.com/products/743> (PRT-00743) Special note: the shrouded connector mates well with our 3x2 ribbon cables: Ribbon Crimp Connector - 6-pin (2x3, Female) <https://www.sparkfun.com/products/10651> (PRT-10651) Ribbon Cable - 6 wire (15ft) <https://www.sparkfun.com/products/10646> (PRT-10646); PROD_ID: CONN-11566
LED1 = SparkFun-LED:7-SEGMENT-4DIGIT-10MM: 4 Digit 7 Segment Display This is a part for the 4-Digit 7-segment LEDs from Young Sun. Different from the Digikey LEDs, all 16 pins are used. The LONGPADS Variant is used for a test jig, but you may like it because there is more pad to solder to. If you are concerned about routing space, the standard works just fine though. Datasheets: Red <http://www.sparkfun.com/datasheets/Components/LED/7-Segment/YSD-439AR6B-35.pdf> Yellow <http://www.sparkfun.com/datasheets/Components/LED/7-Segment/YSD-439AY2B-35.pdf> Kelly Green <http://www.sparkfun.com/datasheets/Components/LED/7-Segment/YSD-439AK2B-35.pdf> Blue <http://www.sparkfun.com/datasheets/Components/LED/7-Segment/YSD-439AB4B-35.pdf> White <http://cdn.sparkfun.com/datasheets/Components/LED/ATA3492BW_2.pdf> SparkFun Products Raw Components 7-Segment Display - 4-Digit (Red) <https://www.sparkfun.com/products/9483> (COM-09483) 7-Segment Display - 4-Digit (Yellow) <https://www.sparkfun.com/products/9480> (COM-09480) 7-Segment Display - 4-Digit (Kelly Green) <https://www.sparkfun.com/products/9482> (COM-09482) 7-Segment Display - 4-Digit (Blue) <https://www.sparkfun.com/products/9481> (COM-09481) 7-Segment Display - 4-Digit (White) <https://www.sparkfun.com/products/10931> ( COM-10931) Serial Controlled SparkFun 7-Segment Serial Display - Red <https://www.sparkfun.com/products/11441> (COM-11441) SparkFun 7-Segment Serial Display - Yellow <https://www.sparkfun.com/products/11443> (COM-11443) SparkFun 7-Segment Serial Display - Kelly Green <https://www.sparkfun.com/products/11440> (COM-11440) SparkFun 7-Segment Serial Display - Blue <https://www.sparkfun.com/products/11442> (COM-11442) SparkFun 7-Segment Serial Display - White <https://www.sparkfun.com/products/11629> (COM-11629) Other SparkFun BigTime Watch Kit <https://www.sparkfun.com/products/11734> (KIT-11734); PROD_ID: COMP-09493
LOGO1 = SparkFun-Aesthetics:OSHW-LOGO: Open-Source Hardware (OSHW) Logo This logo indicates the piece of hardware it is found on incorporates a OSHW license and/or adheres to the definition of open source hardware found here: http://freedomdefined.org/OSHW
Q1-Q4 = SparkFun-DiscreteSemi:TRANS_NPN: NPN transistor Current controlled devices typically used to amplify current or used as a switch. BC547 - COM-08928 <http://www.sparkfun.com/products/8928> (TO-92 45V 100mA) (1.Collector 2.Base 3.Emitter) 2N3904 - COM-00521 <http://www.sparkfun.com/products/521> (TO-92 40V 200mA) (1.Emitter 2.Base 3.Collector) P2N2222A - COM-12852 <http://www.sparkfun.com/products/12852> (TO-92 40V 600mA) (1.Collector 2.Base 3.Emitter); PROD_ID: TRANS-08049
R1 = SparkFun-Resistors:470OHM1/10W1%(0603): RES-07869; PROD_ID: RES-07869
R2 = SparkFun-Resistors:10KOHM-1/10W-1%(0603): RES-00824; PROD_ID: RES-00824
R3-R13 = SparkFun-Resistors:470OHM: 470Ω resistor A resistor is a passive two-terminal electrical component that implements electrical resistance as a circuit element. Resistors act to reduce current flow, and, at the same time, act to lower voltage levels within circuits. - Wikipedia; PROD_ID: RES-07869
R14-R58 = SparkFun-Resistors:470OHM1/10W1%(0603): RES-07869; PROD_ID: RES-07869; VALUE: 470
S1 = SparkFun-Switches:MOMENTARY-SWITCH-SPST: Momentary Switch (Pushbutton) - SPST Normally-open (NO) SPST momentary switches (buttons, pushbuttons). Variants PTH-12MM - 12mm square, through-hole Momentary Pushbutton Switch - 12mm Square <https://www.sparkfun.com/products/9190> (COM-09190) PTH-6.0MM, PTH-6.0MM-KIT - 6.0mm square, through-hole Mini Pushbutton Switch <https://www.sparkfun.com/products/97> (COM-00097) KIT package intended for soldering kit's - only one side of pads' copper is exposed. PTH-RIGHT-ANGLE-KIT - Right-angle, through-hole Right Angle Tactile Button <https://www.sparkfun.com/products/10791> - Used on SparkFun BigTime Watch Kit <https://www.sparkfun.com/products/11734> SMD-12MM - 12mm square, surface-mount Tactile Button - SMD (12mm) <https://www.sparkfun.com/products/12993> (COM-12993) Used on SparkFun PicoBoard <https://www.sparkfun.com/products/11888> SMD-4.5MM - 4.5mm Square Trackball Switch Used on SparkFun Blackberry Trackballer Breakout <https://www.sparkfun.com/products/13169> SMD-4.6MMX2.8MM - 4.60mm x 2.80mm, surface mount Used on SparkFun SAMD21 Mini Breakout <https://www.sparkfun.com/products/13664> SMD-5.2MM, SMD-5.2-REDUNDANT - 5.2mm square, surface-mount Mini Pushbutton Switch - SMD <https://www.sparkfun.com/products/8720> (COM-08720) Used on Arduino Pro Mini <https://www.sparkfun.com/products/11114> REDUNDANT package connects both switch circuits together SMD-6.0X3.5MM - 6.0 x 3.5mm, surface mount Momentary Reset Switch SMD <https://www.sparkfun.com/products/8229> (COM-08229) SMD-6.2MM-TALL - 6.2mm square, surface mount Tactile Button - SMD (6mm) <https://www.sparkfun.com/products/12992> Used on SparkFun Digital Sandbox <https://www.sparkfun.com/products/12651> SMD-RIGHT-ANGLE - Right-angle, surface mount Used on SparkFun Block for Intel® Edison - Arduino <https://www.sparkfun.com/products/13036>; PROD_ID: SWCH-00815; SF_SKU: COM-08229
U1 = SparkFun-PowerIC:MIC5205: MIC5205 150mA vreg 3.3V - VREG-00822 5V - VREG-00823; PROD_ID: VREG-00822
U2 = SparkFun-IC-Microcontroller:ATMEGA168: ATMEGA 168 Atmel 32-pin 8-bit micro, 16k flash. SparkFun Products SparkFun Serial Graphic LCD 128x64 <https://www.sparkfun.com/products/9351> (LCD-09351) SparkFun Graphic LCD Serial Backpack <https://www.sparkfun.com/products/9352> (LCD-09352) SparkFun Serial Graphic LCD 160x128 <https://www.sparkfun.com/products/8884> (LCD-08884); PROD_ID: IC-08594
Y1 = SparkFun-FreqCtrl:RESONATOR: Resonator Small SMD resonator. Used, eg, on the Arduino Pro/ Pro Mini boards. 8MHz- XTAL-08895 16MHz- XTAL-08900; PROD_ID: XTAL-08900

## Board
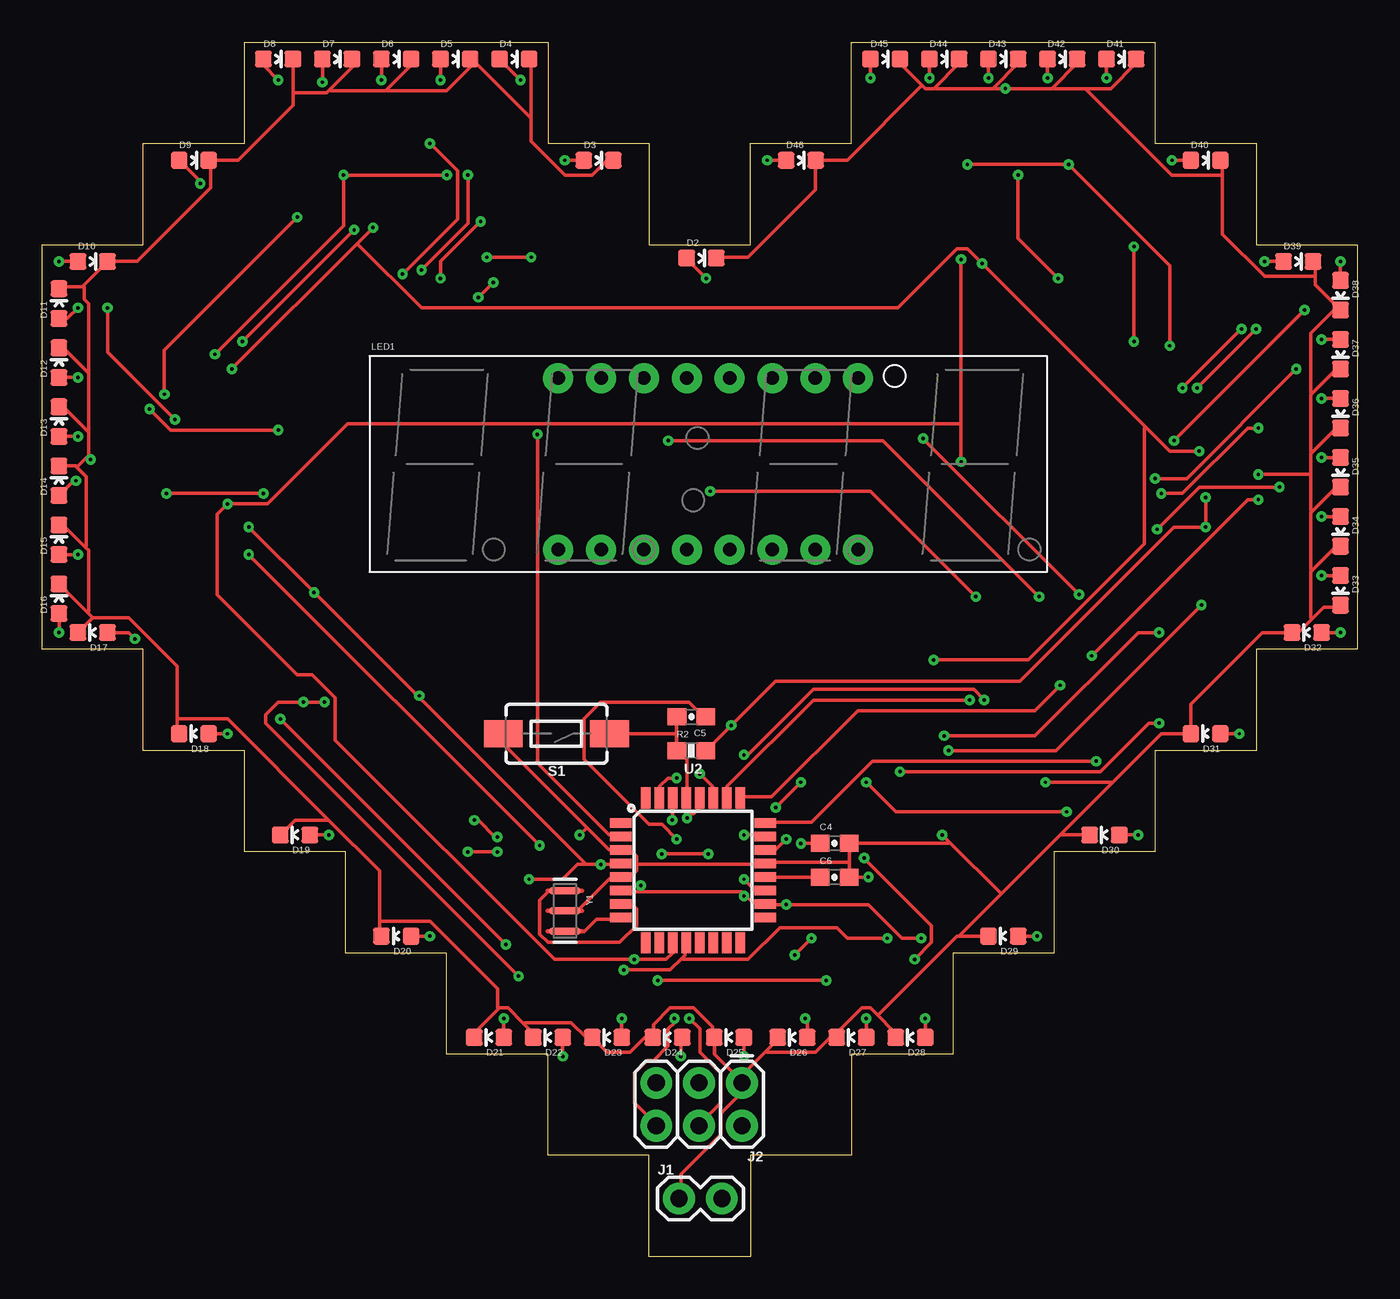
[diagram p6: board, top side]
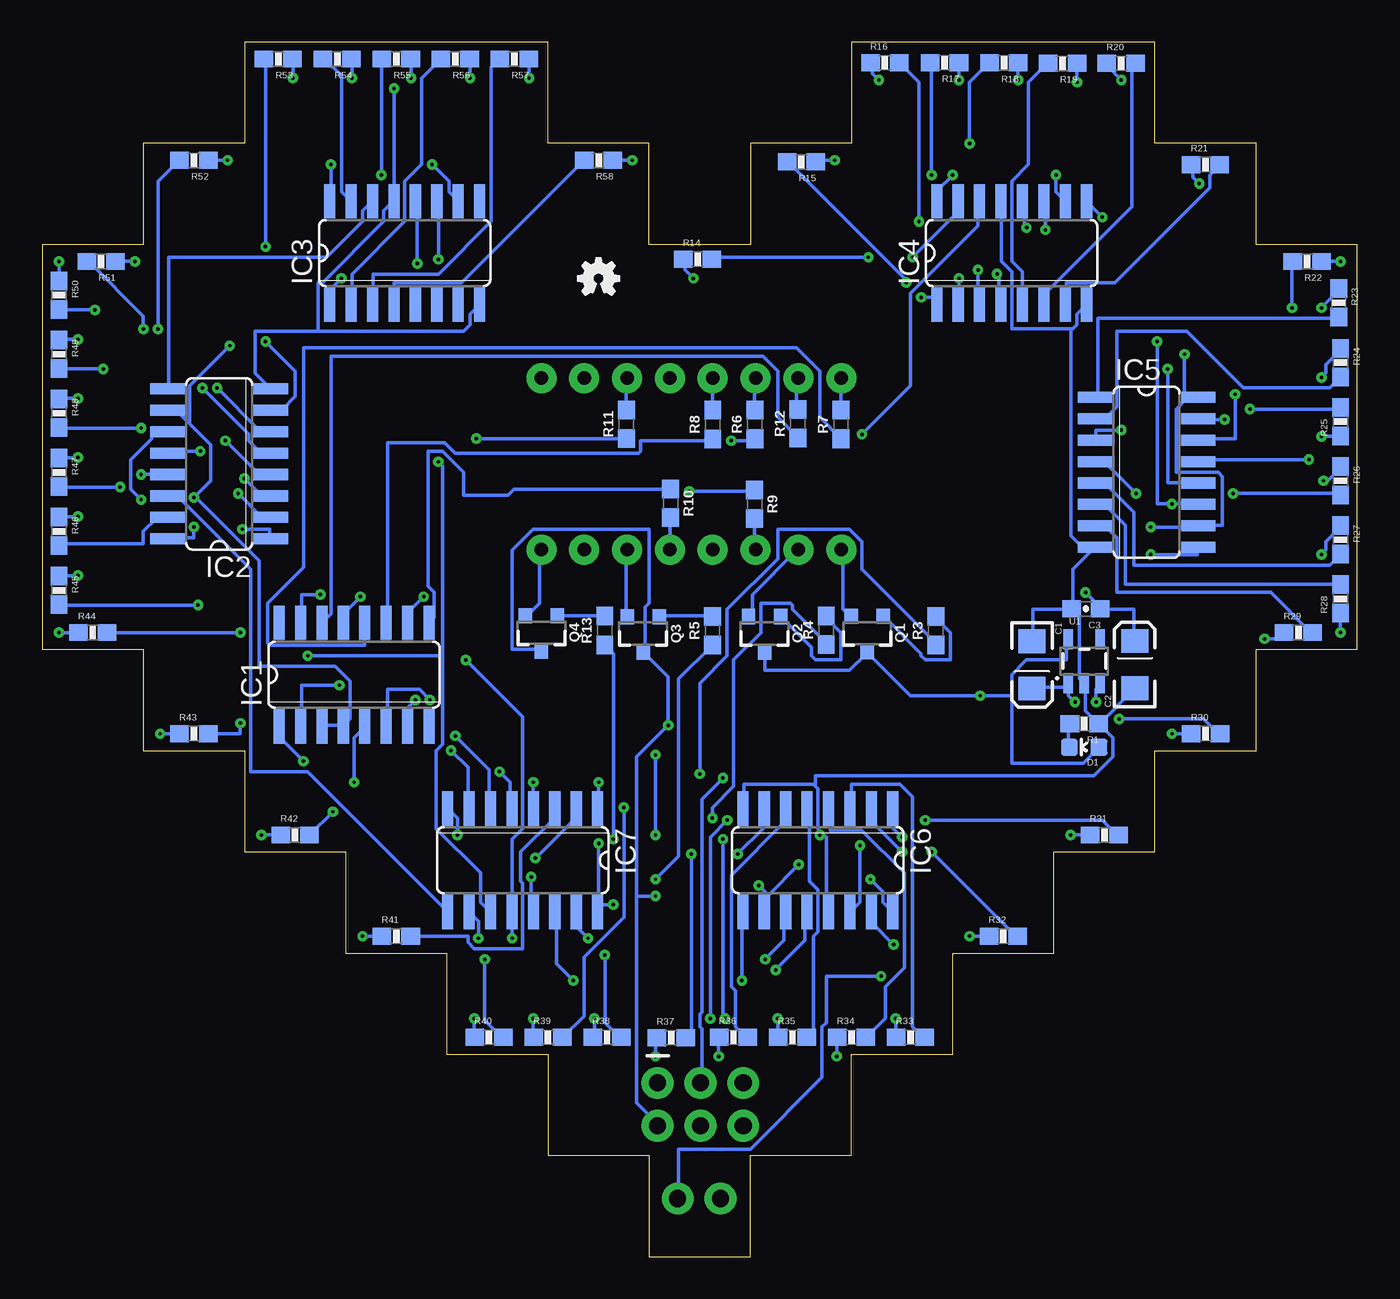
[diagram p7: board, bottom side, seen from below]

Size 78 x 72 mm. Coordinates in mm from the lower left corner, seen from the top.
Outline: 12,72 30,72 30,66 36,66 36,60 42,60 42,66 48,66 48,72 66,72 66,66 72,66 72,60 78,60 78,36 72,36 72,30 66,30 66,24 60,24 60,18 54,18 54,12 48,12 48,6 42,6 42,0 36,0 36,6 30,6 30,12 24,12 24,18 18,18 18,24 12,24 12,30 6,30 6,36 0,36 0,60 6,60 6,66 12,66 12,72
Copper layers (1*16): Top 0.035mm / dielectric 1.5mm / Bottom 0.035mm
Design rules "default *": minimum track width 0.2mm, minimum drill 8mil, track to track 8mil, track to pad 8mil, pad to pad 8mil, via to via 8mil, smd to smd 8mil, copper to edge 10mil, drill to drill 8mil, minimum pad ring 10mil, minimum via ring 8mil, stop-mask expansion 4mil, vias tented up to drill 0mil, thermal gap 10mil
Milling: 44 lines

### Footprints (pad centres in the part's own frame; a part is rotated, then mirrored left to right if it is on the bottom)
EIA3216 = smd 1.4 x 1.6: A 1.4,0; C -1.4,0
0603-CAP = smd 1.1 x 1: 1 -0.85,0; 2 0.85,0
LED-0603 = smd 1 x 1: A 0,-0.877; C 0,0.877
SO16 = smd 0.66 x 2.032: 1 -4.445,-3.073; 2 -3.175,-3.073; 3 -1.905,-3.073; 4 -0.635,-3.073; 5 0.635,-3.073; 6 1.905,-3.073; 7 3.175,-3.073; 8 4.445,-3.073; 9 4.445,3.073; 10 3.175,3.073; 11 1.905,3.073; 12 0.635,3.073; 13 -0.635,3.073; 14 -1.905,3.073; 15 -3.175,3.073; 16 -4.445,3.073
1X02 = drill 1.016 pad 1.88: 1 0,0; 2 2.54,0
2X3 = drill 1.016 pad 1.88: 1 0,0; 2 0,2.54; 3 2.54,0; 4 2.54,2.54; 5 5.08,0; 6 5.08,2.54
7-SEGMENT-4DIGIT-YOUNGSUN = drill 0.8 pad 1.778: 1 -8.89,-5.08; 2 -6.35,-5.08; 3 -3.81,-5.08; 4 -1.27,-5.08; 5 1.27,-5.08; 6 3.81,-5.08; 7 6.35,-5.08; 8 8.89,-5.08; 9 8.89,5.08; 10 6.35,5.08; 11 3.81,5.08; 12 1.27,5.08; 13 -1.27,5.08; 14 -3.81,5.08; 15 -6.35,5.08; 16 -8.89,5.08
SOT23-3 = smd 0.8 x 0.9: 1 -0.95,-1; 2 0.95,-1; 3 0,1.1
0603-RES = smd 1.1 x 1: 1 -0.85,0; 2 0.85,0
0603 = smd 1.1 x 1: 1 -0.85,0; 2 0.85,0
TACTILE_SWITCH_SMD_6.0X3.5MM = smd 2.3 x 1.6: 1 -3.15,0; 2 3.15,0
SOT23-5 = smd 0.55 x 1.2: 1 -0.95,-1.3; 2 0,-1.3; 3 0.95,-1.3; 4 0.95,1.3; 5 -0.95,1.3
TQFP32-08 = smd 1.27 x 0.559: 1 -4.293,2.8; 2 -4.293,2; 3 -4.293,1.2; 4 -4.293,0.4; 5 -4.293,-0.4; 6 -4.293,-1.2; 7 -4.293,-2; 8 -4.293,-2.8; 17 4.293,-2.8; 18 4.293,-2; 19 4.293,-1.2; 20 4.293,-0.4; 21 4.293,0.4; 22 4.293,1.2; 23 4.293,2; 24 4.293,2.8 | smd 0.559 x 1.27: 9 -2.8,-4.293; 10 -2,-4.293; 11 -1.2,-4.293; 12 -0.4,-4.293; 13 0.4,-4.293; 14 1.2,-4.293; 15 2,-4.293; 16 2.8,-4.293; 25 2.8,4.293; 26 2,4.293; 27 1.2,4.293; 28 0.4,4.293; 29 -0.4,4.293; 30 -1.2,4.293; 31 -2,4.293; 32 -2.8,4.293
RESONATOR-SMD = smd 0.45 x 1.905: 1 -1.2,0; 2 0,0; 3 1.2,0

### Placement (x,y rotation side)
C1  19.3,35.08 270 bottom
C2  13.2,35.1 90 bottom
C3  16.1,38.4 180 bottom
C4  47,24.5 0 top
C5  38.5,32 180 top
C6  47,22.5 0 top
D1  16.2,30.2 90 bottom
D2  39.1,59.2 270 top
D3  33,65 270 top
D4  28,71 270 top
D5  24.5,71 270 top
D6  21,71 270 top
D7  17.5,71 270 top
D8  14,71 270 top
D9  9,65 270 top
D10  3,59 270 top
D11  1,56.5 0 top
D12  1,53 0 top
D13  1,49.5 0 top
D14  1,46 0 top
D15  1,42.5 0 top
D16  1,39 0 top
D17  3,37 90 top
D18  9,31 90 top
D19  15,25 90 top
D20  21,19 90 top
D21  26.5,13 90 top
D22  30,13 90 top
D23  33.5,13 90 top
D24  37.09,13 90 top
D25  40.74,13 90 top
D26  44.5,13 90 top
D27  48,13 90 top
D28  51.5,13 90 top
D29  57,19 90 top
D30  63,25 90 top
D31  69,31 90 top
D32  75,37 90 top
D33  77,39.5 180 top
D34  77,43 180 top
D35  77,46.5 180 top
D36  77,50 180 top
D37  77,53.5 180 top
D38  77,57 180 top
D39  74.5,59 270 top
D40  69,65 270 top
D41  64,71 270 top
D42  60.5,71 270 top
D43  57,71 270 top
D44  53.5,71 270 top
D45  50,71 270 top
D46  45,65 270 top
IC1  59.5,34.5 0 bottom
IC2  67.5,47 90 bottom
IC3  56.5,59.5 0 bottom
IC4  20.5,59.5 0 bottom
IC5  12.5,46.5 270 bottom
IC6  32,23.5 180 bottom
IC7  49.5,23.5 180 bottom
J1  37.77,3.45 0 top
J2  41.5,10.3 180 top
LED1  39.5,47 0 top
LOGO1  45,58 0 bottom
Q1  29.07,36.96 180 bottom
Q2  35.16,36.95 180 bottom
Q3  42.36,36.94 180 bottom
Q4  48.39,36.99 180 bottom
R1  16.2,31.6 180 bottom
R2  38.5,30 0 top
R3  25,37.11 90 bottom
R4  31.5,37.13 90 bottom
R5  38.24,37.11 90 bottom
R6  35.73,49.34 90 bottom
R7  30.62,49.34 90 bottom
R8  38.23,49.33 90 bottom
R9  35.75,44.61 270 bottom
R10  40.73,44.66 270 bottom
R11  43.35,49.35 90 bottom
R12  33.18,49.38 90 bottom
R13  44.63,37.12 90 bottom
R14  39.13,59.13 0 bottom
R15  32.97,64.9 180 bottom
R16  28.02,70.77 0 bottom
R17  24.48,70.79 180 bottom
R18  20.96,70.77 180 bottom
R19  17.48,70.75 180 bottom
R20  14.01,70.74 0 bottom
R21  9.01,64.74 0 bottom
R22  2.98,59 180 bottom
R23  1.11,56.55 270 bottom
R24  1,53 270 bottom
R25  1,49.5 90 bottom
R26  1,46 270 bottom
R27  1,42.5 270 bottom
R28  1,39 90 bottom
R29  3.5,37 0 bottom
R30  9,31 0 bottom
R31  15,25 0 bottom
R32  21,19 0 bottom
R33  26.5,13 0 bottom
R34  30,13 0 bottom
R35  33.5,13 0 bottom
R36  37,13 0 bottom
R37  40.69,12.97 0 bottom
R38  44.5,13 0 bottom
R39  48,13 0 bottom
R40  51.5,13 0 bottom
R41  57,19 0 bottom
R42  63,25 0 bottom
R43  69,31 0 bottom
R44  75,37 0 bottom
R45  77,39.5 270 bottom
R46  77,43 270 bottom
R47  77,46.5 270 bottom
R48  77,50 270 bottom
R49  77,53.5 270 bottom
R50  77,57 270 bottom
R51  74.5,59 180 bottom
R52  69,65 180 bottom
R53  64,71 180 bottom
R54  60.5,71 180 bottom
R55  57,71 180 bottom
R56  53.5,71 180 bottom
R57  50,71 180 bottom
R58  45,65 180 bottom
S1  30.5,31 180 top
U1  16.2,35.3 0 bottom
U2  38.6,22.9 0 top
Y1  31,20.5 270 top

### Tracks (layer width: path | path; a pad name or v marks a point on that pad's centre or on a via)
BCD_A  (via drill 0.2)
  Top 0.2: v41.62,25 42.88,25 U2.23 | v41.62,29.75 41.88,29.75 45.75,33.62 55.25,33.62 v55.88,33
  Bottom 0.2: v41.62,29.75 v41.62,25 | v55.88,33 56.25,32.62 56.25,31.5 IC1.7
BCD_B  (via drill 0.2)
  Top 0.2: v62.5,29.38 49.25,29.38 45.62,25.75 43,25.75 U2.24
  Bottom 0.2: v62.5,29.38 63.88,30.75 63.88,31.38 IC1.1
BCD_C  (via drill 0.2)
  Top 0.2: v60.38,33.88 58.88,32.38 48.38,32.38 43.25,27.25 41.5,27.25 U2.25
  Bottom 0.2: v60.38,33.88 62.62,33.88 62.62,31.5 IC1.2
BCD_D  (via drill 0.2)
  Top 0.2: v55,33 45.75,33 40.62,27.88 40.62,27.25 U2.26
  Bottom 0.2: v55,33 55.62,33.62 57.5,33.62 57.5,31.5 IC1.6
D2  (via drill 0.2)
  Top 0.2: v26.38,59.25 v29,59.25
  Bottom 0.2: v29,59.25 38.25,59.25 R14.2 | v26.38,59.25 23.75,61.88 23.75,62.5 IC4.15
D3  (via drill 0.2)
  Top 0.2: v25.88,56.88 v26.75,57.75
  Bottom 0.2: v26.75,57.75 26.75,57.88 33.75,64.88 R15.2 | v25.88,56.88 25,56.88 25,56.5 IC4.1
D4  (via drill 0.2)
  Top 0.2: v26,61.38 23.62,59 v23.62,58
  Bottom 0.2: v26,61.38 26,69.62 27.12,70.75 R16.2 | v23.62,58 23.62,56.5 IC4.2
D5  (via drill 0.2)
  Top 0.2: v25.25,64.12 25.25,61.25 v22.5,58.5
  Bottom 0.2: v25.25,64.12 25.25,70.75 R17.2 | v22.5,58.5 22.5,56.5 IC4.3
D6  (via drill 0.2)
  Top 0.2: v23,66 24.62,64.38 24.62,61.5 v21.38,58.25
  Bottom 0.2: v23,66 23,69.62 21.88,70.75 R18.2 | v21.38,58.25 21.25,58.12 21.25,56.5 IC4.4
D7
  Bottom 0.2: R19.2 18.38,70.75 19.5,69.62 19.5,64.75 20.5,63.75 20.5,59 19.88,58.38 19.88,56.5 IC4.5
D8
  Bottom 0.2: R20.2 13.25,70.62 13.38,70.5 13.38,62.25 18.5,57.12 18.5,56.5 IC4.6
D9
  Bottom 0.2: R21.2 8.25,64.62 8.75,64.12 8.75,63.38 14.38,57.75 17.25,57.75 17.25,56.5 IC4.7
D10  (via drill 0.2)
  Top 0.2: v3.88,56.25 3.88,53.62 v7.88,49.62
  Bottom 0.2: v3.88,56.25 3.88,59 R22.2 | v7.88,49.62 9.38,49.62 IC5.15
D11
  Bottom 0.2: R23.2 1.12,55.62 15.38,55.62 15.38,51.12 15.5,51 IC5.1
D12
  Bottom 0.2: R24.2 1,52.12 1.62,51.5 6.75,51.5 10.12,54.88 14.25,54.88 14.25,50.38 14.88,49.75 15.5,49.75 IC5.2
D13  (via drill 0.2)
  Top 0.2: v6.38,50.25 7.62,49 v14,49
  Bottom 0.2: v6.38,50.25 1,50.25 R25.2 | v14,49 15.5,49 15.5,48.5 IC5.3
D14  (via drill 0.2)
  Top 0.2: v13.12,45.25 v7.38,45.25
  Bottom 0.2: v7.38,45.25 1,45.25 R26.2 | v13.12,45.25 15,47.12 15.5,47.12 IC5.4
D15
  Bottom 0.2: R27.2 1,41.62 1.62,41 13.25,41 13.25,44.12 14.88,45.75 15.5,45.75 IC5.5
D16
  Bottom 0.2: R28.2 1,39.88 13.75,39.88 13.75,43.38 14.88,44.5 15.5,44.5 IC5.6
D17
  Bottom 0.2: R29.2 2.75,37 5.12,39.38 14.25,39.38 14.25,42.62 14.88,43.25 15.5,43.25 IC5.7
D18  (via drill 0.2)
  Top 0.2: v27.5,18.5 v14.12,31.88
  Bottom 0.2: v14.12,31.88 9.12,31.88 8.25,31 R30.2 | v27.5,18.5 28.75,19.75 28.75,20.38 IC6.15
D19  (via drill 0.2)
  Top 0.2: v25.62,25.88 25.88,25.88 26.88,24.88 v27,24.88
  Bottom 0.2: v25.62,25.88 15.12,25.88 14.25,25 R31.2 | v27,24.88 27.5,25.38 27.5,26.5 IC6.1
D20  (via drill 0.2)
  Top 0.2: v27,24 v25.25,24
  Bottom 0.2: v25.25,24 20.25,19 R32.2 | v27,24 28.75,25.75 28.75,26.5 IC6.2
D21
  Bottom 0.2: R33.2 25.75,13 26.38,13.62 26.38,27.25 27.12,28 30,28 30,26.62 IC6.3
D22
  Bottom 0.2: R34.2 29.12,13 28,14.12 28,16 26.88,17.12 26.88,22.75 29.38,25.25 31.25,25.25 31.25,26.5 IC6.4
D23
  Bottom 0.2: R35.2 32.62,13 32.25,13.38 32.25,19 32,19.25 32,21.75 32.5,22.25 32.5,26.38 32.62,26.5 IC6.5
D24
  Bottom 0.2: R36.2 36.25,13 36.88,13.62 36.88,15.75 37.12,16 37.12,22.62 34,25.75 34,26.5 IC6.6
D25  (via drill 0.2)
  Top 0.2: v36.75,23.88 v39.5,23.88
  Bottom 0.2: v39.5,23.88 39.5,13.25 39.75,13 R37.2 | v36.75,23.88 35.25,25.38 35.25,26.5 IC6.7
D26  (via drill 0.2)
  Top 0.2: v45.62,18.88 v44.62,17.88
  Bottom 0.2: v44.62,17.88 44.62,13.88 43.75,13 R38.2 | v45.62,18.88 46.25,19.5 46.25,20.38 IC7.15
D27  (via drill 0.2)
  Top 0.2: v45,28.12 v43.5,26.62
  Bottom 0.2: v43.5,26.62 43.5,20.12 45.88,17.75 45.88,14.25 47.12,13 R39.2 | v45,28.12 45,26.62 IC7.1
D28  (via drill 0.2)
  Top 0.2: v51.75,17.62 52.75,18.62 52.75,19.62 v48.75,23.62
  Bottom 0.2: v51.75,17.62 51.75,14 50.75,13 R40.2 | v48.75,23.62 46.38,26 46.38,26.5 IC7.2
D29
  Bottom 0.2: R41.2 52.75,19 52.75,18.62 52.38,18.25 49.5,18.25 49.5,22.12 49.62,22.25 49.62,24 47.62,26 47.62,26.5 IC7.3
D30  (via drill 0.2)
  Top 0.2: v60.75,26.38 50.62,26.38 v48.88,28.12
  Bottom 0.2: v60.75,26.38 62.12,25 R42.2 | v48.88,28.12 48.88,26.62 IC7.4
D31  (via drill 0.2)
  Top 0.2: v66.25,31.62 65.62,31.62 62.75,28.75 v50.88,28.75
  Bottom 0.2: R43.2 66.25,31 v66.25,31.62 | v50.88,28.75 50.25,28.12 50.25,26.62 IC7.5
D32  (via drill 0.2)
  Top 0.2: v66.25,37 65,37 58.88,30.88 v53.5,30.88
  Bottom 0.2: v66.25,37 R44.2 | v53.5,30.88 51.5,28.88 51.5,26.62 IC7.6
D33  (via drill 0.2)
  Top 0.2: v68.75,38.62 60.12,30 v53.75,30
  Bottom 0.2: v68.75,38.62 77,38.62 R45.2 | v53.75,30 52.75,29 52.75,26.62 IC7.7
D34
  Bottom 0.2: R46.2 77,42.25 72,42.25 72,43 71.25,43.75 70.62,43.75 IC2.15
D35  (via drill 0.2)
  Top 0.2: v73.38,45.62 68.62,45.62 v66.12,43.12
  Bottom 0.2: v73.38,45.62 77,45.62 R47.2 | v66.12,43.12 64.5,43.12 64.5,42.62 IC2.1
D36  (via drill 0.2)
  Top 0.2: v72.12,49.12 71.5,49.12 67.62,45.25 v66.38,45.25
  Bottom 0.2: v72.12,49.12 77,49.12 R48.2 | v66.38,45.25 65,43.88 64.5,43.88 IC2.2
D37  (via drill 0.2)
  Top 0.2: v74.38,52.62 67.88,46.12 v66,46.12
  Bottom 0.2: v74.38,52.62 77,52.62 R49.2 | v66,46.12 65,45.12 64.5,45.12 IC2.3
D38  (via drill 0.2)
  Top 0.2: v67.12,48.38 v74.88,56.12
  Bottom 0.2: v74.88,56.12 77,56.12 R50.2 | v67.12,48.38 65.12,46.38 64.5,46.38 IC2.4
D39  (via drill 0.2)
  Top 0.2: v68.5,51.5 v72,55
  Bottom 0.2: v72,55 72,55.75 75.25,59 R51.2 | v68.5,51.5 65.75,48.75 65.75,48.38 65.12,47.75 64.5,47.75 IC2.5
D40  (via drill 0.2)
  Top 0.2: v67.62,51.5 v71.12,55
  Bottom 0.2: v71.12,55 71.12,63.75 69.88,65 R52.2 | v67.62,51.5 65.12,49 64.5,49 IC2.6
D41  (via drill 0.2)
  Top 0.2: v64.75,54.25 v64.75,59.88
  Bottom 0.2: v64.75,59.88 64.75,71 R53.2 | v64.75,54.25 63,52.5 63,51 63.75,50.25 64.38,50.25 IC2.7
D42
  Bottom 0.2: R54.2 61.25,71 60.25,70 60.25,63.12 59.75,62.62 IC3.15
D43  (via drill 0.2)
  Top 0.2: v57.88,64.12 57.88,60.38 v60.25,58
  Bottom 0.2: v57.88,64.12 57.88,71 R55.2 | v60.25,58 60.88,57.38 60.88,56.5 IC3.1
D44
  Bottom 0.2: R56.2 54.38,71 55.5,69.88 55.5,64.75 56.5,63.75 56.5,61.38 59.62,58.25 59.62,56.5 IC3.2
D45
  Bottom 0.2: R57.2 50.88,71 51.38,70.5 51.38,61.38 54.5,58.25 58.38,58.25 58.38,56.5 IC3.3
D46
  Bottom 0.2: R58.2 45.88,65 53.12,57.75 57.12,57.75 57.12,56.5 IC3.4
DEETE  (via drill 0.2)
  Top 0.2: v16.75,32.88 v15.5,32.88 14,32.88 13.25,32.12 13.25,31.62 v28.25,16.62
  Bottom 0.2: v15.5,32.88 15.5,33.62 15.25,33.88 U1.3 | v16.75,32.88 17.12,33.25 17.12,33.75 | 17.12,33.75 17.12,33.88 U1.1 17.12,33.75 | 17.12,33.75 19.25,33.75 C1.A | v28.25,16.62 31.5,16.62 31.5,13.88 31.75,13.62 31.75,10.62 36,6.38 40.25,6.38 40.25,3.5 J1.2
DISP_D1  (via drill 0.2)
  Top 0.2: v39,28.62 39.75,27.88 39.75,27.25 U2.27
  Bottom 0.2: v39,28.62 39,34 37.38,35.62 37.38,38.38 34.38,41.38 34.38,43.12 30.12,43.12 29.38,42.38 29.38,40.75 25,36.38 R3.1
DISP_D2  (via drill 0.2)
  Top 0.2: v38.25,26 38.5,26.25 38.62,26.25 39,26.62 U2.28
  Bottom 0.2: v38.25,26 38.25,26.62 37,27.88 37,35.38 35.38,37 35.38,38.75 33.62,38.75 33.5,38.62 33.5,38.38 31.5,36.38 R4.1
DISP_D3  (via drill 0.2)
  Top 0.2: v41.62,22.38 42.25,21.75 42.88,21.75 U2.19
  Bottom 0.2: R5.1 40.25,34.25 40.25,23.75 v41.62,22.38
DISP_D4  (via drill 0.2)
  Top 0.2: v44.12,24.75 43.5,24.12 43,24.12 U2.22
  Bottom 0.2: v44.12,24.75 44.12,35.75 44.62,36.25 R13.1
DTR  (via drill 0.2)
  Top 0.2: v37.62,24.75 36.75,25.62 36,25.62 32.12,29.5 32.12,31.88 33.12,32.88 38.38,32.88 39.25,32 C5.1 | v37.5,14.12 37.5,13.88 37.12,13.5 37.12,12.5 36.25,11.62 35.88,11.62 35.12,10.88 35.12,9.12 36.38,7.88 J2.6
  Bottom 0.2: v37.62,24.75 37.62,14.25 v37.5,14.12
GND  (via drill 0.2)
  Top 0.2: D3.C 33.5,65 32.62,64.12 31,64.12 29,66.12 29,67.5 | 29,67.5 29,71 D4.C | 29,67.5 25.5,71 D5.C 25.62,70.75 24,69.12 20.5,69.12 20.44,69.19 | 10,65 11.62,65 14.88,68.25 14.88,69 | 14.88,69 D8.C | 17.06,69.19 16.88,69 14.88,69 | 17.06,69.19 18.38,70.5 D7.C | 20.44,69.19 20.38,69.12 17.12,69.12 17.06,69.19 | 20.44,69.19 21.88,70.62 D6.C | 2.44,57.56 D10.C 5.62,59 10,63.38 10,65 | 2.44,57.56 2.38,57.5 1,57.5 D11.C | 8,31.88 8,35 5.12,37.88 3,37.88 | 8,31.88 8,31 D18.C | 3,37.88 D17.C | 3,37.88 2.69,38.19 | 2.69,38.19 D16.C | 2.56,42.06 2.75,41.88 2.75,38.25 2.69,38.19 | 2.56,42.06 1.25,43.38 D15.C | 2.06,46.81 2.62,46.25 2.62,42.12 2.56,42.06 | 2.06,46.81 2,46.88 D14.C | 2.69,48.94 2.75,48.88 2.75,47.5 2.69,47.44 | 2.69,48.94 1.25,50.38 D13.C | 2.06,46.81 2.69,47.44 | 2.69,52.44 2.75,52.38 2.75,49 2.69,48.94 | 2.69,52.44 1.25,53.88 D12.C | 2.69,47.44 v2.88,47.25 | 2.44,57.56 2.5,57.5 2.5,56.75 2.75,56.5 2.75,52.5 2.69,52.44 | 10,65 D9.C | 75.5,58.12 75.5,57.62 D38.C 76.75,56.25 75.25,54.75 75.25,51.25 75.31,51.19 | 75.5,58.12 75.5,59 D39.C | 70,64.12 70,60.62 72.5,58.12 75.5,58.12 | 70,64.12 70,65 D40.C | 75.31,37.81 76,38.5 77,38.5 D33.C | 75.31,37.81 74.5,37 D32.C 72.38,37 68.12,32.75 D31.C 66.38,31 63.44,28.06 | 75.31,40.69 75.25,40.62 75.25,37.88 75.31,37.81 | 75.31,40.69 76.62,42 77,42 D34.C | 75.31,44.19 75.25,44.12 75.25,40.75 75.31,40.69 | 75.31,44.19 76.62,45.5 77,45.5 D35.C | 75.31,47.69 75.25,47.62 75.25,46.38 | 75.31,47.69 76.62,49 77,49 D36.C | 75.25,46.38 75.25,44.25 75.31,44.19 | 75.31,51.19 75.25,51.12 75.25,47.75 75.31,47.69 | 75.31,51.19 76.62,52.5 77,52.5 D37.C | 75.25,46.38 v72.12,46.38 | D2.C 40,59.25 41.88,59.25 45.88,63.25 D46.C 47.75,65 52.19,69.44
  Top 0.2: 52.19,69.44 52.38,69.25 52.88,69.25 52.94,69.31 | 52.19,69.44 51,70.62 51,71 D45.C | 52.94,69.31 54.38,70.75 D44.C | 56.44,69.31 56.38,69.25 53,69.25 52.94,69.31 | 56.44,69.31 57.88,70.75 D43.C | 59.94,69.31 59.88,69.25 v57.12,69.25 56.5,69.25 56.44,69.31 | 59.94,69.31 61.38,70.75 D42.C | 61.88,69.25 60,69.25 59.94,69.31 | 61.88,69.25 63.38,69.25 64.88,70.75 D41.C | 70,64.12 67,64.12 61.88,69.25 | Y1.2 31.88,20.62 33.75,22.5 U2.5 34.88,22.5 35.25,22.88 35.25,23.25 | 35.25,23.25 35.25,23.75 35,24 34.38,24 U2.3 34.25,24.12 33.62,24.12 32.31,25.44 | 32.31,25.44 27.38,30.38 27.38,31 S1.2 | 32.31,25.44 v31.88,25 | 20,19.88 20,22.88 17,25.88 | 20,19.88 20,19 D20.C | 17,25.88 15,25.88 D19.C | 27.06,14.69 27.12,14.75 27.62,14.75 28.56,13.81 | 27.06,14.69 25.62,13.25 D21.C | 28.56,13.81 29,13.38 29,13 D22.C | 28.56,13.81 28.62,13.88 31.38,13.88 32.25,13 D23.C 33.5,12.12 34.88,12.12 35.75,13 D24.C 36.25,13 36.25,13.75 37.25,14.75 38.62,14.75 39.75,13.62 39.75,13 D25.C 39.88,13 39.88,12 41.5,10.38 J2.1 | 47.88,24.5 47.88,23.38 | 47.88,23.38 47.88,22.5 | 47.88,23.38 43,23.38 U2.21 42.88,23.25 35.25,23.25 | 47.88,22.5 v49,22.5 | 47.88,22.5 C6.2 | 42.94,12.19 41.38,10.62 J2.1 | 42.94,12.19 43.5,12.75 43.5,13 D26.C | 46.88,13 46.75,13 45.88,12.12 43,12.12 42.94,12.19 | 46.88,13 D27.C 47,13 | 49.56,14.31 49.12,14.75 48.62,14.75 46.88,13 | 49.56,14.31 50.5,13.38 50.5,13 D28.C | 54.38,19 54.25,19 49.56,14.31 | 54.38,19 D29.C | 60.38,25 D30.C | 54.38,19 56.88,21.5 | 56.88,21.5 60.38,25 | 60.38,25 63.44,28.06 | 56.88,21.5 53.81,24.56 | 53.81,24.56 v53.38,25 | v59.5,28.12 63.38,28.12 63.44,28.06 | J2.1 41.5,9.75 40.25,8.5 40.25,7.25 37.88,4.88 37.88,3.5 J1.1
  Top 0.2: 47.88,24.5 53.75,24.5 53.81,24.56 | 47.88,24.5 C4.2 | 20,19.88 23,19.88 27,15.88 27,14.75 27.06,14.69 | 8,31.88 11,31.88 17,25.88
  Bottom 0.2: v2.88,47.25 9.38,47.25 IC5.13 | v72.12,46.38 70.62,46.38 IC2.13 | 61.62,54.88 65.38,54.88 65.38,52.38 64.5,51.5 IC2.8 | 61.62,54.88 53,54.88 52.62,55.25 52.62,55.88 52.12,56.38 IC3.8 | 61.62,54.88 61.62,57.75 61.38,57.75 57.75,61.38 57.75,62 57.25,62.5 IC3.13 57.12,62.62 v57.12,69.25 | 17,55 20.5,55 20.5,58.38 21.12,59 21.12,62.5 IC4.13 | 17,55 16.88,55 16.62,55.25 16.62,55.88 16.12,56.38 IC4.8 | R1.1 16.12,32.38 16.12,33.88 U1.2 16.25,34 16.5,34.25 16.5,38 16.88,38.38 C3.2 | C2.C 13.25,33.62 15.25,31.62 R1.1 | C3.2 17,38.38 19.25,38.38 19.25,36.5 C1.C | C3.2 16.88,38.5 16.88,40.75 15.62,42 IC5.8 16,41.75 17,42.75 17,55 | 31.81,25.19 32,25.38 32,27.75 32.19,27.94 | 31.81,25.19 31.5,24.88 31.5,20.62 31.38,20.5 IC6.13 | 32.19,27.94 32.25,28 36.38,28 36.38,26.62 IC6.8 | v31.88,25 31.88,25.12 31.81,25.19 | v49,22.5 49,20.62 48.88,20.5 IC7.13 | v53.38,25 53.38,26 53.88,26.5 IC7.8 | v59.5,28.12 59.5,30.75 58.88,31.38 IC1.5 | R1.1 14.5,30.75 14.5,29.62 15.62,28.5 32.12,28.5 32.12,28 32.19,27.94
LED_RCK  (via drill 0.2)
  Top 0.2: v19.62,61 18.69,60.06 | 18.69,60.06 v11.25,52.62 | 37.94,17.69 37.25,17 v34.5,17 | 37.94,17.69 38.12,17.88 38.12,18.5 U2.12 | v50.12,18.88 47.75,18.88 47.12,19.5 43.75,19.5 41.88,17.62 38,17.62 37.94,17.69 | v68.62,47.75 66.88,47.75 65.44,49.19 | 65.44,49.19 v55.75,58.88 54.88,59.75 54.25,59.75 50.75,56.25 22.5,56.25 18.69,60.06 | v52.88,35.38 58.5,35.38 65.38,42.25 65.38,49.12 65.44,49.19
  Bottom 0.2: v11.25,52.62 11.25,45.88 9.5,45.88 IC5.12 | v19.62,61 19.75,61.12 19.75,62.5 IC4.12 | v34.5,17 32.75,18.75 32.75,20.38 IC6.12 | v50.12,18.88 50.12,20.38 IC7.12 50.12,20.5 50.12,24.75 49.5,25.38 49.5,32 v52.88,35.38 | v68.62,47.75 70.5,47.75 IC2.12 | v55.75,58.88 55.75,62.5 IC3.12
LED_SCK  (via drill 0.2)
  Top 0.2: v54.5,59.12 54.5,49.38 | 54.5,49.38 v54.5,47.12 | v72.12,44.88 71.5,44.88 v62.25,35.62 | U2.11 37.38,18.5 37.38,18 37,17.62 v35.12,17.62 30.38,17.62 17.38,30.62 17.38,33.12 16,34.5 15.12,34.5 10.38,39.25 10.38,44 v11,44.62 13.38,44.62 18.12,49.38 54.5,49.38 | v18.5,60.88 v11.88,54.25
  Bottom 0.2: 54.25,35.62 54.25,46.88 v54.5,47.12 | 54.25,35.62 54.25,30.38 54.62,30 54.62,25.38 52,22.75 52,21 51.5,20.5 IC7.11 | v54.5,59.12 54.5,62.5 IC3.11 | v72.12,44.88 72.75,45.5 72.75,47.25 71.5,48.5 71.5,48.88 70.62,48.88 IC2.11 | 54.25,35.62 v62.25,35.62 | v35.12,17.62 34,18.75 34,20.38 IC6.11 | v11.88,54.25 11.88,44.62 v11,44.62 9.5,44.62 IC5.11 | v18.5,60.88 18.5,62.5 IC4.11
LED_SERIAL  (via drill 0.2)
  Top 0.2: v29.38,48.75 29.38,29.25 33.62,25 34.25,25 U2.2
  Bottom 0.2: v29.38,48.75 26.5,51.62 26.5,57.12 22.5,61.12 22.5,62.5 IC4.14
N$1  (via drill 0.2)
  Top 0.2: v39.38,58 38.25,59.12 D2.A
  Bottom 0.2: v39.38,58 39.88,58.5 39.88,59.12 R14.1
N$2  (via drill 0.2)
  Top 0.2: v31,65 D3.A
  Bottom 0.2: v31,65 32,65 R15.1
N$3  (via drill 0.2)
  Top 0.2: v28.38,69.75 D4.A
  Bottom 0.2: v28.38,69.75 28.75,70.12 28.75,70.75 R16.1
N$4  (via drill 0.2)
  Top 0.2: v23.62,69.75 D5.A
  Bottom 0.2: v23.62,69.75 23.62,70.75 R17.1
N$5  (via drill 0.2)
  Top 0.2: v20.12,69.75 D6.A
  Bottom 0.2: v20.12,69.75 20.12,70.75 R18.1
N$6  (via drill 0.2)
  Top 0.2: v16.62,69.62 D7.A
  Bottom 0.2: v16.62,69.62 R19.1
N$7  (via drill 0.2)
  Top 0.2: v14,69.75 13.12,70.62 D8.A
  Bottom 0.2: v14,69.75 14.75,70.5 14.75,70.62 R20.1
N$8  (via drill 0.2)
  Top 0.2: v9.38,63.62 9.38,63.75 D9.A
  Bottom 0.2: v9.38,63.62 9.75,64 9.75,64.62 R21.1
N$9  (via drill 0.2)
  Top 0.2: v1,59 D10.A
  Bottom 0.2: R22.1 v1,59
N$10  (via drill 0.2)
  Top 0.2: v2.12,56.25 1.5,55.62 D11.A
  Bottom 0.2: v2.12,56.25 1.12,57.25 1.12,57.38 R23.1
N$11  (via drill 0.2)
  Top 0.2: v2.12,52.12 D12.A
  Bottom 0.2: v2.12,52.12 1.88,52.38 1.88,52.88 1,53.75 R24.1
N$12  (via drill 0.2)
  Top 0.2: v2.12,48.62 D13.A
  Bottom 0.2: v2.12,48.62 D13.A R25.1
N$13  (via drill 0.2)
  Top 0.2: v2,46 1.88,46 D14.A
  Bottom 0.2: v2,46 1.75,46 1,46.75 R26.1
N$14  (via drill 0.2)
  Top 0.2: v2.12,41.62 D15.A
  Bottom 0.2: v2.12,41.62 1.88,41.88 1.88,42.38 1,43.25 R27.1
N$15  (via drill 0.2)
  Top 0.2: v1,37 D16.A
  Bottom 0.2: R28.1 v1,37
N$16  (via drill 0.2)
  Top 0.2: D17.A 5.12,37 v5.5,36.62
  Bottom 0.2: v5.5,36.62 4.38,36.62 4.38,37 R29.1
N$17  (via drill 0.2)
  Top 0.2: v11,31 D18.A
  Bottom 0.2: R30.1 v11,31
N$18  (via drill 0.2)
  Top 0.2: v17,25 D19.A
  Bottom 0.2: R31.1 v17,25
N$19  (via drill 0.2)
  Top 0.2: v23,19 D20.A
  Bottom 0.2: R32.1 v23,19
N$20  (via drill 0.2)
  Top 0.2: v27.38,14.12 D21.A
  Bottom 0.2: v27.38,14.12 D21.A R33.1
N$21  (via drill 0.2)
  Top 0.2: v30.88,11.88 D22.A
  Bottom 0.2: v30.88,11.88 D22.A R34.1
N$22  (via drill 0.2)
  Top 0.2: v34.38,14.12 D23.A
  Bottom 0.2: v34.38,14.12 D23.A R35.1
N$23  (via drill 0.2)
  Top 0.2: v37.88,11.88 37.88,13 D24.A
  Bottom 0.2: v37.88,11.88 37.88,13 R36.1
N$24  (via drill 0.2)
  Top 0.2: v41.62,11.88 D25.A
  Bottom 0.2: v41.62,11.88 41.62,12.88 R37.1
N$25  (via drill 0.2)
  Top 0.2: v45.25,14.12 45.38,14 D26.A
  Bottom 0.2: v45.25,14.12 45.25,13 R38.1
N$26  (via drill 0.2)
  Top 0.2: v48.88,14.12 D27.A
  Bottom 0.2: v48.88,14.12 D27.A R39.1
N$27
  Top 0.2: U2.7 34.38,20.88 35,20.88 35.25,20.62 35.25,19.62 34.25,18.62 30,18.62 29.5,19.12 29.5,21.12 30,21.62 Y1.1
N$28
  Top 0.2: U2.8 34.25,20 32.88,20 32.12,19.25 32.02,19.3
N$29
  Top 0.2: U2.20 C6.1
N$30
  Top 0.2: 37.62,31 37.62,32 C5.2 | 37.62,31 37.62,30 R2.1 37.75,30 38.25,29.5 38.25,27.25 U2.29 | 37.62,31 S1.1
N$31  (via drill 0.2)
  Top 0.2: v39.62,45.38 49.12,45.38 v55.38,39.12
  Bottom 0.2: v39.62,45.38 35.75,45.38 R9.1 | v55.38,39.12 56.25,38.25 56.25,37.62 IC1.10
N$32
  Bottom 0.2: D1.C 17.12,30.25 17.12,31.5 R1.2
N$33
  Bottom 0.2: R8.1 38.25,48.38 42.5,48.38 42.5,47.75 42.62,47.62 53.5,47.62 54.12,48.25 57.5,48.25 57.5,37.62 IC1.11
N$34
  Bottom 0.2: R7.1 31.88,49.75 31.88,52.5 33.25,53.88 62.5,53.88 62.5,40.88 64.62,38.75 64.62,36.38 64.5,36.25 58.88,36.25 58.88,37.5 IC1.12
N$35  (via drill 0.2)
  Top 0.2: v37.12,48.38 49.88,48.38 v59.12,39.12
  Bottom 0.2: v37.12,48.38 35.75,48.38 R6.1 | v59.12,39.12 60.12,38.12 60.12,37.62 IC1.13
N$36
  Bottom 0.2: R10.1 40.75,45.5 50,45.5 50.38,45.12 53,45.12 53,46.5 54.25,47.75 55.12,47.75 55.12,39.75 54.75,39.38 54.75,37.88 55,37.62 IC1.9
N$37  (via drill 0.2)
  Top 0.2: v61.5,39.25 v52.25,48.5
  Bottom 0.2: v52.25,48.5 R11.1 | v61.5,39.25 62.62,39.25 62.62,37.62 IC1.15
N$38
  Bottom 0.2: R12.1 33.25,48.62 34.38,49.75 34.38,52.5 35.25,53.38 60.88,53.38 60.88,38.12 61.38,37.62 IC1.14
N$39
  Bottom 0.2: R6.2 35.75,50.25 35.75,52 LED1.14
N$40  (via drill 0.2)
  Top 0.2: v7.25,51.12 7.25,53.75 v15.12,61.62
  Bottom 0.2: v7.25,51.12 7.25,48.5 9.38,48.5 IC5.14 | v15.12,61.62 16,62.5 IC4.9
N$41  (via drill 0.2)
  Top 0.2: v46.5,16.38 v36.5,16.38
  Bottom 0.2: v36.5,16.38 36.5,20.38 IC6.9 | v46.5,16.38 47.5,17.38 47.5,20.38 IC7.14
N$42
  Bottom 0.2: R7.2 30.62,50.25 30.62,52 LED1.16
N$43
  Bottom 0.2: R8.2 38.25,50.25 38.25,52 LED1.13
N$44
  Bottom 0.2: R9.2 35.75,42 LED1.3
N$45
  Bottom 0.2: R10.2 40.75,43.75 40.75,42 LED1.5
N$46
  Bottom 0.2: R11.2 43.38,50.25 43.38,52 LED1.11
N$47
  Bottom 0.2: R12.2 33.25,50.25 33.25,52 LED1.15
N$48
  Bottom 0.2: Q4.2 49.25,38 48.5,38.75 48.5,41.88 LED1.8
N$49
  Bottom 0.2: Q3.2 43.38,38 43.38,41.88 LED1.6
N$50
  Bottom 0.2: Q2.2 36,38 35.88,38.12 35.88,39.25 33.25,41.88 LED1.2
N$51
  Bottom 0.2: Q1.2 30.12,38 30.5,38.38 30.5,41.88 LED1.1
N$52
  Bottom 0.2: Q2.1 34.12,37.88 32.38,36.12 32.38,35.62 32.12,35.38 30.62,35.38 30.62,37 31.5,37.88 R4.2
N$53
  Bottom 0.2: Q4.1 47.38,38 44.75,38 R13.2
N$54
  Bottom 0.2: Q3.1 41.38,38 38.25,38 R5.2
N$55
  Bottom 0.2: Q1.1 28,37.88 25.88,35.75 25.88,35.62 25.62,35.38 24.12,35.38 24.12,37 25,37.88 R3.2
N$56  (via drill 0.2)
  Top 0.2: v52.38,14.12 D28.A
  Bottom 0.2: v52.38,14.12 D28.A R40.1
N$57  (via drill 0.2)
  Top 0.2: v59,19 D29.A
  Bottom 0.2: R41.1 v59,19
N$58  (via drill 0.2)
  Top 0.2: v65,25 D30.A
  Bottom 0.2: R42.1 v65,25
N$59  (via drill 0.2)
  Top 0.2: v71,31 D31.A
  Bottom 0.2: R43.1 v71,31
N$60  (via drill 0.2)
  Top 0.2: v77,37 D32.A
  Bottom 0.2: R44.1 v77,37
N$61  (via drill 0.2)
  Top 0.2: v75.88,40.38 D33.A
  Bottom 0.2: v75.88,40.38 D33.A R45.1
N$62  (via drill 0.2)
  Top 0.2: v75.88,43.88 D34.A
  Bottom 0.2: v75.88,43.88 D34.A R46.1
N$63
  Bottom 0.2: IC3.14 58.5,62.5 59,62 59,61.38 61.12,59.25 70.5,59.25 70.5,51.5 IC2.9
N$64  (via drill 0.2)
  Top 0.2: v75.88,47.38 D35.A
  Bottom 0.2: v75.88,47.38 D35.A R47.1
N$65  (via drill 0.2)
  Top 0.2: v75.88,50.88 D36.A
  Bottom 0.2: v75.88,50.88 D36.A R48.1
N$66  (via drill 0.2)
  Top 0.2: v75.88,54.38 D37.A
  Bottom 0.2: v75.88,54.38 D37.A R49.1
N$67  (via drill 0.2)
  Top 0.2: v77,59 D38.A
  Bottom 0.2: R50.1 v77,59
N$68  (via drill 0.2)
  Top 0.2: v72.5,59 D39.A
  Bottom 0.2: R51.1 v72.5,59
N$69  (via drill 0.2)
  Top 0.2: v67,65 D40.A
  Bottom 0.2: R52.1 v67,65
N$70  (via drill 0.2)
  Top 0.2: v63.12,69.88 D41.A
  Bottom 0.2: v63.12,69.88 D41.A R53.1
N$71  (via drill 0.2)
  Top 0.2: v59.62,69.88 D42.A
  Bottom 0.2: v59.62,69.88 D42.A R54.1
N$72  (via drill 0.2)
  Top 0.2: v56.12,69.88 D43.A
  Bottom 0.2: v56.12,69.88 D43.A R55.1
N$73  (via drill 0.2)
  Top 0.2: v52.62,69.88 D44.A
  Bottom 0.2: v52.62,69.88 D44.A R56.1
N$74  (via drill 0.2)
  Top 0.2: v49.12,69.88 D45.A
  Bottom 0.2: v49.12,69.88 D45.A R57.1
N$75  (via drill 0.2)
  Top 0.2: v43,65 D46.A
  Bottom 0.2: R58.1 v43,65
N$104  (via drill 0.2)
  Top 0.2: v12.25,41.62 v29.5,24.38
  Bottom 0.2: v29.5,24.38 29.5,21 30,20.5 IC6.14 | v12.25,41.62 9.5,41.62 9.5,42 IC5.9
OUT
  Bottom 0.2: IC7.9 54,20.5 62.25,28.75 65.62,28.75 65.62,40.75 69.88,45 70.5,45 IC2.14
RX  (via drill 0.2)
  Top 0.2: v37.62,28.38 37.12,28.38 36.62,27.88 36.62,27.25 U2.31
  Bottom 0.2: v37.62,28.38 38.88,27.12 38.88,14.5 39,14.38 39,13.62 38.88,13.5 38.88,10.38 J2.3
TX  (via drill 0.2)
  Top 0.2: v37.38,25.88 37.38,27.12 U2.30 | v38.38,14.12 39,13.5 39,12.12 40.25,10.88 40.25,9.12 39,7.88 J2.4
  Bottom 0.2: v37.38,25.88 38.38,24.88 v38.38,14.12
VCC  (via drill 0.2)
  Top 0.2: v54.88,64.75 v60.88,64.75 66.88,58.75 v66.88,54 | v69,45 v69,43.25 67.12,43.25 58,34.12 43.5,34.12 v40.88,31.5 39.38,30 R2.2 | v45,24.5 C4.1 | 35.5,21.62 41.5,21.62 41.69,21.44 | 35.5,21.62 34.38,21.62 U2.6 | 41.69,21.44 42.12,21 42.88,21 U2.18 43,20.88 v44.12,20.88 49,20.88 51,18.88 v52.12,18.88 | v24,64.12 v17.88,64.12 17.88,61.12 v10.25,53.5 | U2.4 34.25,23.25 v33.12,23.25 32.25,23.25 | v28.88,22.38 30.88,22.38 31.75,23.25 32.25,23.25 | 32.25,23.25 22.31,33.19 | 22.31,33.19 v16.12,39.38 v12.25,43.25 | v35.5,22 35.5,21.62 | v22.38,33.25 22.31,33.19 | v41.62,21.38 41.69,21.44
  Bottom 0.2: v54.88,64.75 53.88,63.75 53.88,63.12 53.38,62.62 IC3.10 | v60.88,64.75 60.88,62.62 IC3.16 | IC1.3 61.38,31.5 60.25,31.5 IC1.4 60.12,31.5 59.75,31.88 59.75,34.12 60.62,35 65.12,35 65.12,41.25 68.88,45 v69,45 68,46 68,48.12 69.31,49.44 | v69,43.25 69,42.62 70.5,42.62 IC2.16 | 69.31,49.44 70,50.12 70.5,50.12 IC2.10 | v66.88,54 69.25,51.62 69.25,49.5 69.31,49.44 | Q4.3 48.5,36 50.12,36 50.12,41.88 48.88,43.12 42,43.12 42,38.75 42.25,38.5 42.25,35.88 Q3.3 42.25,35.75 40.88,34.38 v40.88,31.5 42.75,29.62 42.75,21.38 | 42.75,21.38 42.75,9.12 41.5,7.88 J2.2 | Q2.3 35.12,35.75 35.12,34.75 30.12,34.75 29.12,35.75 Q1.3 29,35.75 26.5,33.25 v22.38,33.25 20.5,33.25 | 20.5,33.25 20.5,34.5 19.62,35.38 17.25,35.38 17.25,36.5 U1.5 | 20.5,33.25 20.5,29.25 16.25,29.25 15.38,30.12 D1.A | 45,20.88 45,20.5 IC7.16 45,20.88 | 45,20.88 v45,24.5 | v52.12,18.88 52.12,19.88 52.62,20.38 IC7.10 | v44.12,20.88 45,20.88 | v17.88,64.12 17.88,63.12 17.38,62.62 IC4.10 | v24,64.12 24.88,63.25 24.88,62.62 IC4.16 | C2.A 13.25,36.5 13.25,38.38 15.25,38.38 C3.1 15.25,38.5 v16.12,39.38 | 34.94,21.44 35.12,21.25 35.12,20.5 IC6.10 | 34.94,21.44 v33.12,23.25 | v28.88,22.38 28.12,21.62 28.12,21 27.62,20.5 IC6.16 | v12.25,43.25 9.5,43.25 IC5.10 9.38,43.38 8,43.38 8,46.25 8.25,46.5 10.75,46.5 10.75,50.25 10.12,50.88 9.5,50.88 IC5.16 10.25,50.88 v10.25,53.5 | 34.94,21.44 v35.5,22 | v41.62,21.38 42.75,21.38